# EAGLE design schmatic (EAGLE 9.6.2)

## Sheet 1 of 3
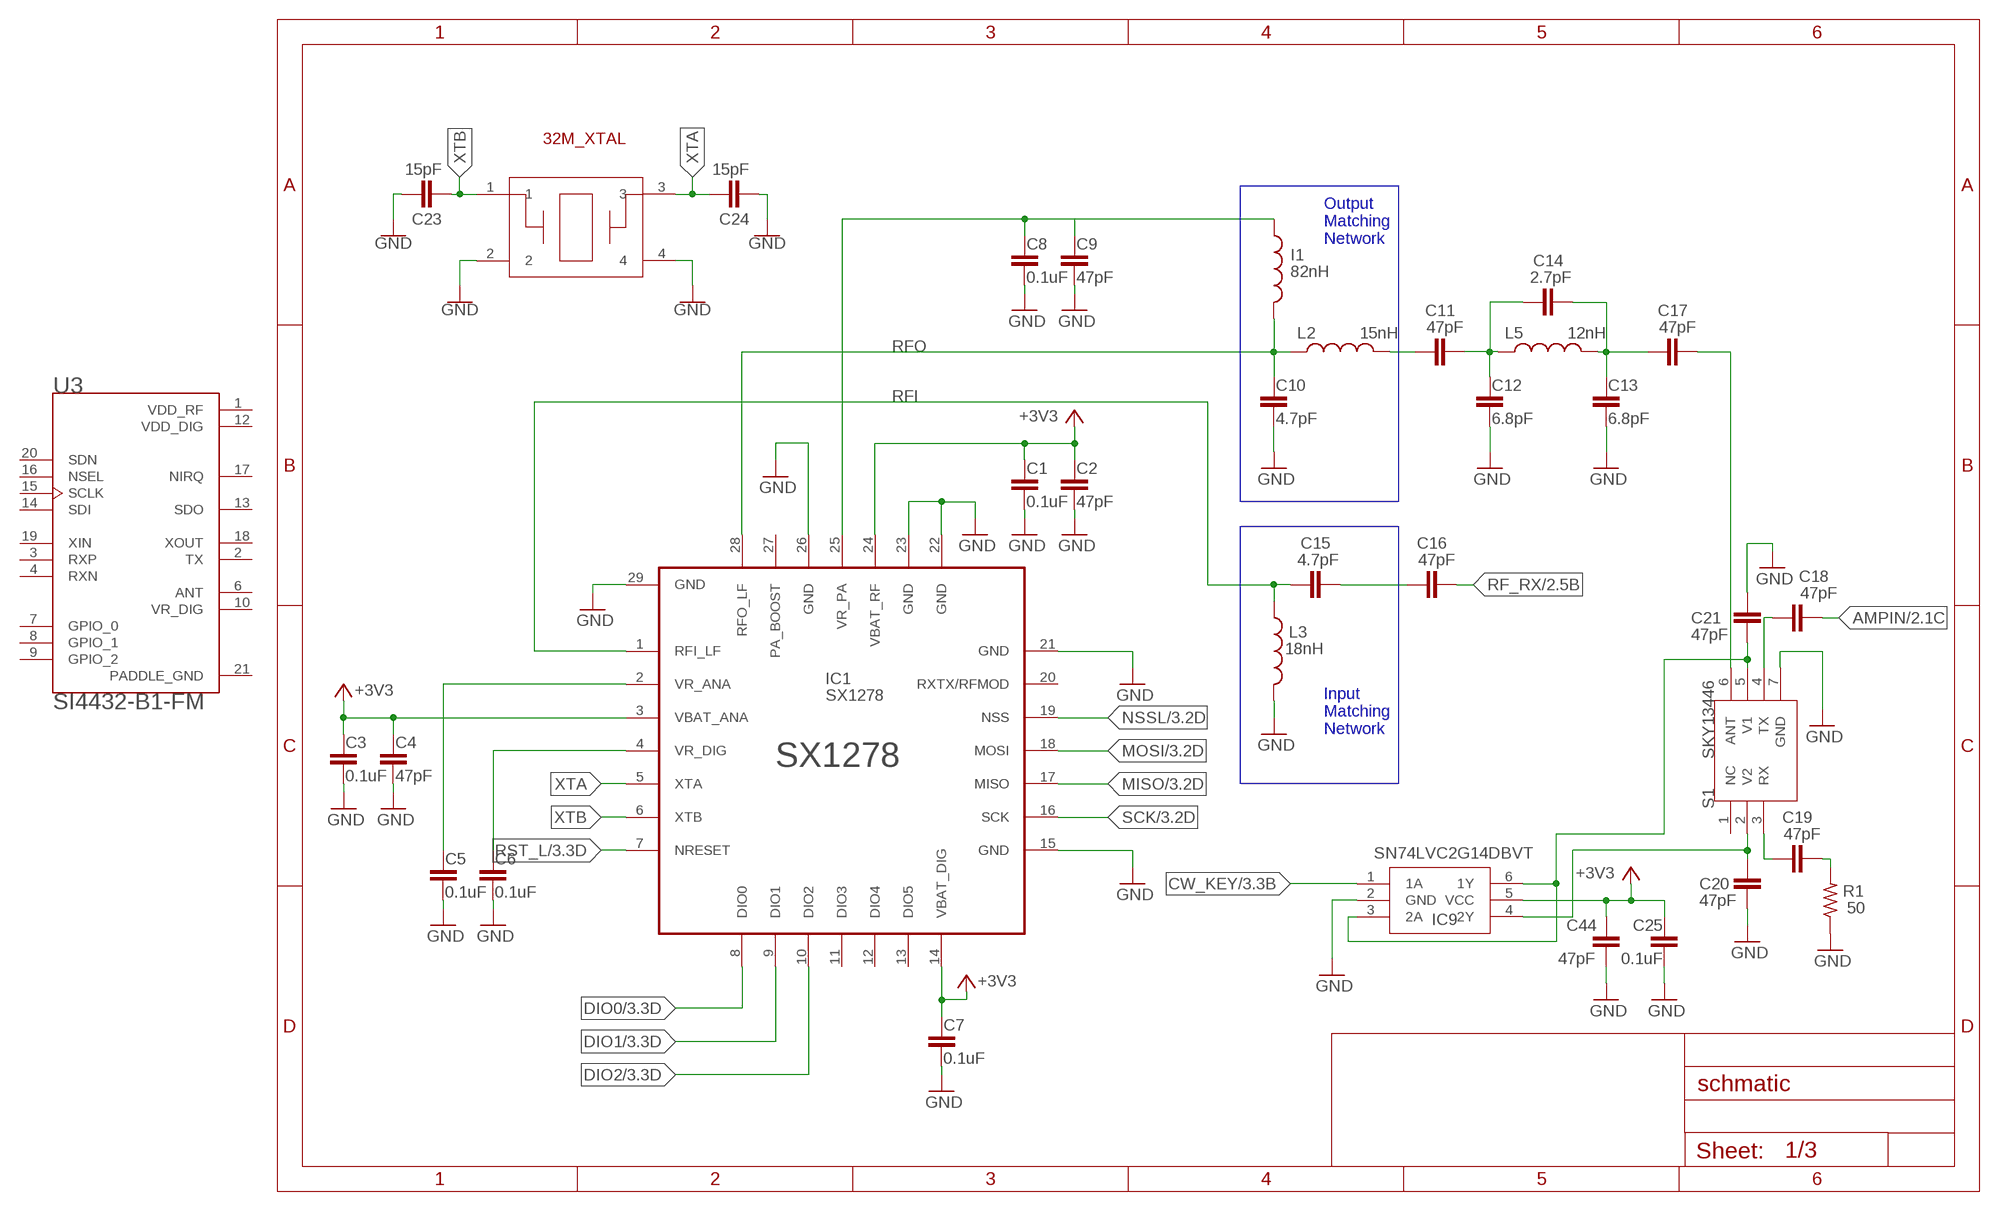
[diagram p0: schematic, sheet 1]

### Parts
C1  0.1uF  CAPACITOR  [M(1005)_US(0402)]
C2  47pF  CAPACITOR  [M(1005)_US(0402)]
C3  0.1uF  CAPACITOR  [M(1005)_US(0402)]
C4  47pF  CAPACITOR  [M(1005)_US(0402)]
C5  0.1uF  CAPACITOR  [M(1005)_US(0402)]
C6  0.1uF  CAPACITOR  [M(1005)_US(0402)]
C7  0.1uF  CAPACITOR  [M(1005)_US(0402)]
C8  0.1uF  CAPACITOR  [M(1005)_US(0402)]
C9  47pF  CAPACITOR  [M(1005)_US(0402)]
C10  4.7pF  CAPACITOR  [M(1005)_US(0402)]
C11  47pF  CAPACITOR  [M(1005)_US(0402)]
C12  6.8pF  CAPACITOR  [M(1005)_US(0402)]
C13  6.8pF  CAPACITOR  [M(1005)_US(0402)]
C14  2.7pF  CAPACITOR  [M(1005)_US(0402)]
C15  4.7pF  CAPACITOR  [M(1005)_US(0402)]
C16  47pF  CAPACITOR  [M(1005)_US(0402)]
C17  47pF  CAPACITOR  [M(1005)_US(0402)]
C18  47pF  CAPACITOR  [M(1005)_US(0402)]
C19  47pF  CAPACITOR  [M(1005)_US(0402)]
C20  47pF  CAPACITOR  [M(1005)_US(0402)]
C21  47pF  CAPACITOR  [M(1005)_US(0402)]
C23  15pF  CAP_(M1005)_0402  [CAP_(M1005)_0402]
C24  15pF  CAP_(M1005)_0402  [CAP_(M1005)_0402]
C25  0.1uF  CAPACITOR  [M(1005)_US(0402)]
C44  47pF  CAPACITOR  [M(1005)_US(0402)]
I1  82nH  INDUCTOR1608  [M(1608)_US(0603)]
IC1  SX1278  [SX1278]
IC9  SN74LVC2G14DBVT  SN74LVC2G34DBVR  [SOT-23-6]
L2  15nH  INDUCTOR  [M(1005)_US(0402)]
L3  18nH  INDUCTOR  [M(1005)_US(0402)]
L5  12nH  INDUCTOR  [M(1005)_US(0402)]
Q1  NX2520SA-32MHZ  [NX2520SA]
R1  50  RESISTOR1608  [M(1608)_US(0603)]
S1  SKY13446  [SKY13446]
U3  SI4432-B1-FM  [QFN50P400X400X90-21N]

### Nets
+3V1: C5.1 IC1.2(VR_ANA)
+3V2: C6.1 IC1.4(VR_DIG)
+3V3: C1.1 C2.1 C3.1 C4.1 C7.1 C25.1 C44.1 IC1.3(VBAT_ANA) IC1.14(VBAT_DIG) IC1.24(VBAT_RF) IC9.5(VCC) ; also sheet 2,3
+3V4: C8.1 C9.1 I1.1 IC1.25(VR_PA)
AMPIN: C18.2 ; also sheet 2
CW_KEY: IC9.1(1A) ; also sheet 3
DIO0: IC1.8(DIO0) ; also sheet 3
DIO1: IC1.9(DIO1) ; also sheet 3
DIO2: IC1.10(DIO2) ; also sheet 3
GND: C1.2 C2.2 C3.2 C4.2 C5.2 C6.2 C7.2 C8.2 C9.2 C10.2 C12.2 C13.2 C20.1 C21.2 C23.1 C24.2 C25.2 C44.2 IC1.15(GND) IC1.21(GND) IC1.22(GND) IC1.23(GND) IC1.26(GND) IC1.29(GND) IC9.2(GND) L3.2 Q1.2 Q1.4 R1.1 S1.7(GND) ; also sheet 2,3
MISO: IC1.17(MISO) ; also sheet 3
MOSI: IC1.18(MOSI) ; also sheet 3
N$1: C11.1 L2.2
N$2: C11.2 C12.1 C14.1 L5.1
N$3: C13.1 C14.2 C17.1 L5.2
N$4: C17.2 S1.6(ANT)
N$5: C15.2 C16.1
N$6: C18.1 S1.4(TX)
N$7: C19.1 S1.3(RX)
N$8: C19.2 R1.2
N$11: C20.2 IC9.4(2Y) S1.2(V2)
N$27: C21.1 IC9.3(2A) IC9.6(1Y) S1.5(V1)
NSSL: IC1.19(NSS) ; also sheet 3
RF_RX: C16.2 ; also sheet 2
RFI: C15.1 IC1.1(RFI_LF) L3.1
RFO: C10.1 I1.2 IC1.28(RFO_LF) L2.1
RST_L: IC1.7(NRESET) ; also sheet 3
SCK: IC1.16(SCK) ; also sheet 3
XTA: C24.1 IC1.5(XTA) Q1.3
XTB: C23.2 IC1.6(XTB) Q1.1
Unconnected: IC1.11(DIO3) IC1.12(DIO4) IC1.13(DIO5) IC1.20(RXTX/RFMOD) IC1.27(PA_BOOST) S1.1(NC) U3.2(TX) U3.3(RXP) U3.4(RXN) U3.6(ANT) U3.7(GPIO_0) U3.8(GPIO_1) U3.9(GPIO_2) U3.10(VR_DIG) U3.13(SDO) U3.14(SDI) U3.15(SCLK) U3.16(NSEL) U3.17(NIRQ) U3.18(XOUT) U3.19(XIN) U3.20(SDN) U3.21(PADDLE_GND)

### Buses
B$1
B$2

### Notes on the sheet
- 32M_XTAL
- Output
  Matching
  Network
- Input
  Matching
  Network

## Sheet 2 of 3
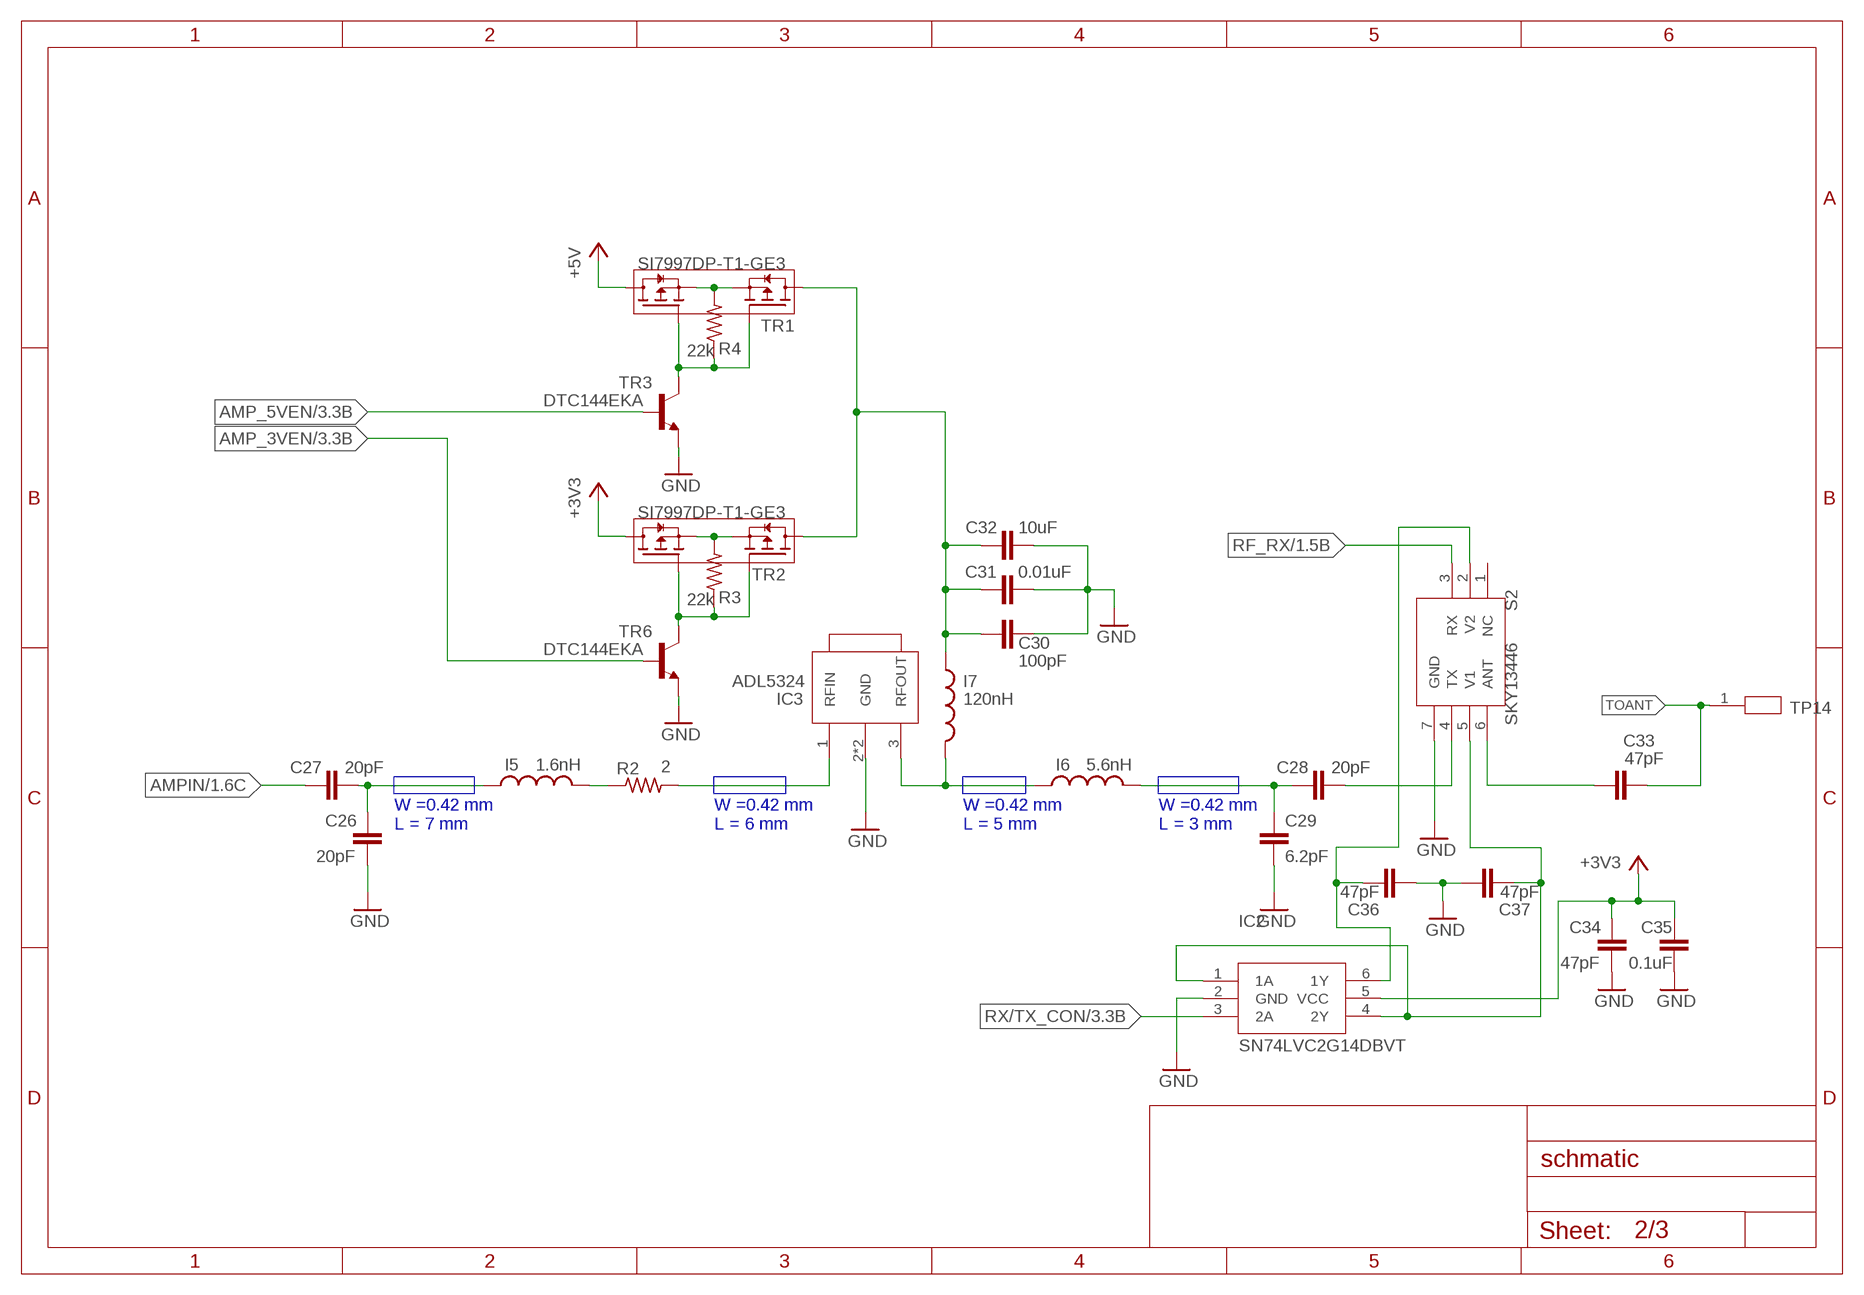
[diagram p1: schematic, sheet 2]

### Parts
C26  20pF  CAPACITOR  [M(1005)_US(0402)]
C27  20pF  CAPACITOR  [M(1005)_US(0402)]
C28  20pF  CAPACITOR  [M(1005)_US(0402)]
C29  6.2pF  CAPACITOR  [M(1005)_US(0402)]
C30  100pF  CAPACITOR  [M(1005)_US(0402)]
C31  0.01uF  CAPACITOR  [M(1005)_US(0402)]
C32  10uF  CAPACITOR1608  [M(1608)_US(0603)]
C33  47pF  CAPACITOR  [M(1005)_US(0402)]
C34  47pF  CAPACITOR  [M(1005)_US(0402)]
C35  0.1uF  CAPACITOR  [M(1005)_US(0402)]
C36  47pF  CAPACITOR  [M(1005)_US(0402)]
C37  47pF  CAPACITOR  [M(1005)_US(0402)]
I5  1.6nH  INDUCTOR  [M(1005)_US(0402)]
I6  5.6nH  INDUCTOR  [M(1005)_US(0402)]
I7  120nH  INDUCTOR2012  [M(2012)_US(0805)]
IC2  SN74LVC2G14DBVT  SN74LVC2G34DBVR  [SOT-23-6]
IC3  ADL5324  [ADL5324]
R2  2  RESISTOR1608  [M(1608)_US(0603)]
R3  22k  RESISTOR1608  [M(1608)_US(0603)]
R4  22k  RESISTOR1608  [M(1608)_US(0603)]
S2  SKY13446  [SKY13446]
TP14  TEST_POINT  [TEST_POINT_1.5MM]
TR1  SI7997DP-T1-GE3  [SI7997DP-T1-GE3]
TR2  SI7997DP-T1-GE3  [SI7997DP-T1-GE3]
TR3  DTC144EKA  [SOT346-R]
TR6  DTC144EKA  [SOT346-R]

### Nets
+3V3: C34.1 C35.1 IC2.5(VCC) TR2.7(D1) TR2.8(D1) TR2.10(D1) ; also sheet 1,3
+3V5: C30.1
+5V: TR1.7(D1) TR1.8(D1) TR1.10(D1) ; also sheet 3
AMP_3VEN: TR6.2(B) ; also sheet 3
AMP_5VEN: TR3.2(B) ; also sheet 3
AMPIN: C27.1 ; also sheet 1
AMPPWR: C30.2 C31.2 C32.1 I7.1 TR1.5(D2) TR1.6(D2) TR1.9(D2) TR2.5(D2) TR2.6(D2) TR2.9(D2)
GND: C26.2 C29.2 C31.1 C32.2 C34.2 C35.2 C36.1 C37.2 IC2.2(GND) IC3.2(GND) IC3.4(GND) S2.7(GND) TR3.1(E) TR6.1(E) ; also sheet 1,3
N$9: C26.1 C27.2 I5.1
N$10: C37.1 IC2.1(1A) IC2.4(2Y) S2.5(V1)
N$12: I5.2 R2.1
N$13: IC3.1(RFIN) R2.2
N$14: I6.1 I7.2 IC3.3(RFOUT)
N$15: C28.1 C29.1 I6.2
N$16: C28.2 S2.4(TX)
N$17: C33.1 S2.6(ANT)
N$18: R4.2 TR1.1(S1) TR1.3(S2)
N$19: R3.2 TR2.1(S1) TR2.3(S2)
N$20: C36.2 IC2.6(1Y) S2.2(V2)
N$22: R4.1 TR1.2(G1) TR1.4(G2) TR3.3(C)
N$23: R3.1 TR2.2(G1) TR2.4(G2) TR6.3(C)
RF_RX: S2.3(RX) ; also sheet 1
RX/TX_CON: IC2.3(2A) ; also sheet 3
TOANT: C33.2 TP14.1
Unconnected: S2.1(NC)

### Buses
B$3
B$4
B$5
B$6

### Notes on the sheet
- W =0.42 mm
  L = 7 mm
- W =0.42 mm
  L = 6 mm
- W =0.42 mm
  L = 5 mm
- W =0.42 mm
  L = 3 mm

## Sheet 3 of 3
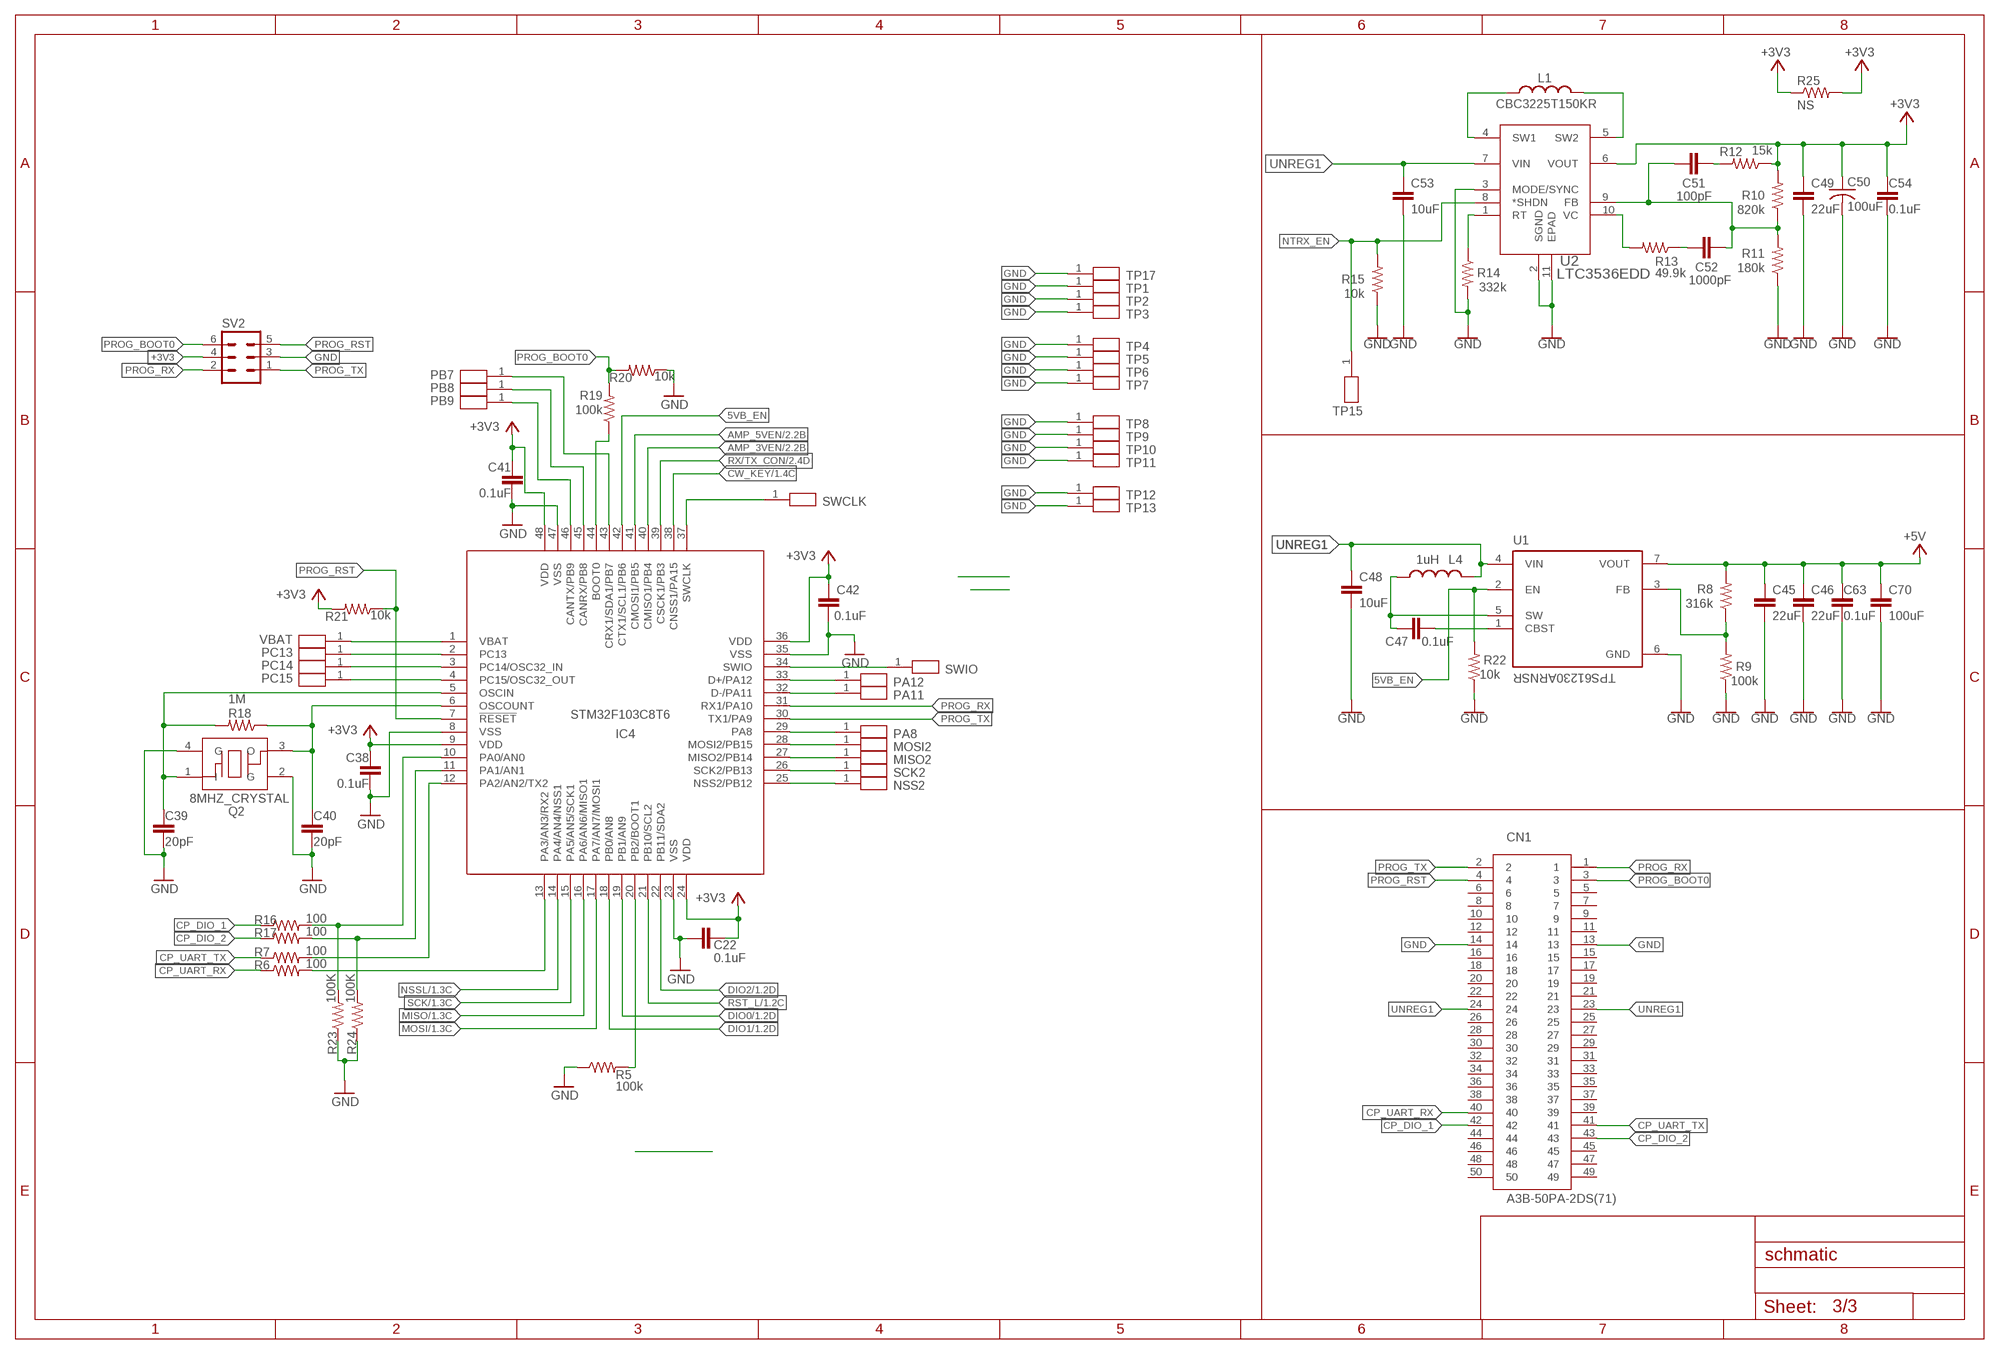
[diagram p2: schematic, sheet 3]

### Parts
C22  0.1uF  CAPACITOR  [M(1005)_US(0402)]
C38  0.1uF  CAPACITOR  [M(1005)_US(0402)]
C39  20pF  CAPACITOR  [M(1005)_US(0402)]
C40  20pF  CAPACITOR  [M(1005)_US(0402)]
C41  0.1uF  CAPACITOR  [M(1005)_US(0402)]
C42  0.1uF  CAPACITOR  [M(1005)_US(0402)]
C45  22uF  CAPACITOR1608  [M(1608)_US(0603)]
C46  22uF  CAPACITOR1608  [M(1608)_US(0603)]
C47  0.1uF  CAPACITOR  [M(1005)_US(0402)]
C48  10uF  CAPACITOR1608  [M(1608)_US(0603)]
C49  22uF  CAPACITOR1608  [M(1608)_US(0603)]
C50  100uF  C-USC1210  [C1210]
C51  100pF  CAPACITOR  [M(1005)_US(0402)]
C52  1000pF  CAPACITOR  [M(1005)_US(0402)]
C53  10uF  CAPACITOR1608  [M(1608)_US(0603)]
C54  0.1uF  CAPACITOR  [M(1005)_US(0402)]
C63  0.1uF  CAPACITOR  [M(1005)_US(0402)]
C70  100uF  CAPACITOR2012  [M(2012)_US(0805)]
CN1  A3B-50PA-2DS(71)  [A3B-50PA-2DS(71)]
IC4  STM32F103C8T6  [STM32F103C8T6]
L1  CBC3225T150KR  INDUCTOR3225  [M(3225)_US(1210)]
L4  1uH  AMDLA3020S-1R5MT  [AMDLA3020S-1R5MT]
MISO2  TEST_POINT  [TEST_POINT_1.5MM]
MOSI2  TEST_POINT  [TEST_POINT_1.5MM]
NSS2  TEST_POINT  [TEST_POINT_1.5MM]
PA8  TEST_POINT  [TEST_POINT_1.5MM]
PA11  TEST_POINT  [TEST_POINT_1.5MM]
PA12  TEST_POINT  [TEST_POINT_1.5MM]
PB7  TEST_POINT  [TEST_POINT_1.5MM]
PB8  TEST_POINT  [TEST_POINT_1.5MM]
PB9  TEST_POINT  [TEST_POINT_1.5MM]
PC13  TEST_POINT  [TEST_POINT_1.5MM]
PC14  TEST_POINT  [TEST_POINT_1.5MM]
PC15  TEST_POINT  [TEST_POINT_1.5MM]
Q2  8MHZ_CRYSTAL  [ECS-80-18-30B-JEM-TR]
R5  100k  RESISTOR  [M(1005)_US(0402)]
R6  100  RESISTOR  [M(1005)_US(0402)]
R7  100  RESISTOR  [M(1005)_US(0402)]
R8  316k  RESISTOR1608  [M(1608)_US(0603)]
R9  100k  RESISTOR1608  [M(1608)_US(0603)]
R10  820k  RESISTOR1608  [M(1608)_US(0603)]
R11  180k  RESISTOR1608  [M(1608)_US(0603)]
R12  15k  RESISTOR1608  [M(1608)_US(0603)]
R13  49.9k  RESISTOR1608  [M(1608)_US(0603)]
R14  332k  RESISTOR1608  [M(1608)_US(0603)]
R15  10k  RESISTOR  [M(1005)_US(0402)]
R16  100  RESISTOR  [M(1005)_US(0402)]
R17  100  RESISTOR  [M(1005)_US(0402)]
R18  1M  RESISTOR1608  [M(1608)_US(0603)]
R19  100k  RESISTOR  [M(1005)_US(0402)]
R20  10k  RESISTOR  [M(1005)_US(0402)]
R21  10k  RESISTOR  [M(1005)_US(0402)]
R22  10k  RESISTOR  [M(1005)_US(0402)]
R23  100K  RESISTOR  [M(1005)_US(0402)]
R24  100K  RESISTOR  [M(1005)_US(0402)]
R25  NS  RESISTOR2012  [M(2012)_US(0805)]
SCK2  TEST_POINT  [TEST_POINT_1.5MM]
SV2  MA03-2  [MA03-2]
SWCLK  TEST_POINT  [TEST_POINT_1.5MM]
SWIO  TEST_POINT  [TEST_POINT_1.5MM]
TP1  TEST_POINT  [TEST_POINT_1.5MM]
TP2  TEST_POINT  [TEST_POINT_1.5MM]
TP3  TEST_POINT  [TEST_POINT_1.5MM]
TP4  TEST_POINT  [TEST_POINT_1.5MM]
TP5  TEST_POINT  [TEST_POINT_1.5MM]
TP6  TEST_POINT  [TEST_POINT_1.5MM]
TP7  TEST_POINT  [TEST_POINT_1.5MM]
TP8  TEST_POINT  [TEST_POINT_1.5MM]
TP9  TEST_POINT  [TEST_POINT_1.5MM]
TP10  TEST_POINT  [TEST_POINT_1.5MM]
TP11  TEST_POINT  [TEST_POINT_1.5MM]
TP12  TEST_POINT  [TEST_POINT_1.5MM]
TP13  TEST_POINT  [TEST_POINT_1.5MM]
TP15  TEST_POINT  [TEST_POINT_1.5MM]
TP17  TEST_POINT  [TEST_POINT_1.5MM]
U1  TPS61230ARNSR  [IC_TPS61230ARNSR]
U2  LTC3536EDD  LTC3536EDD#TRPBF  [DFN-10_DD]
VBAT  TEST_POINT  [TEST_POINT_1.5MM]

### Nets
5VB_EN: IC4.42(CTX1/SCL1/PB6) R22.2 U1.2(EN)
+3V3: C22.1 C38.1 C41.1 C42.1 C49.1 C50.1 C54.1 IC4.9(VDD) IC4.24(VDD) IC4.36(VDD) IC4.48(VDD) R10.2 R12.1 R21.2 R25.1 R25.2 SV2.4 U2.6(VOUT) ; also sheet 1,2
+5V: C45.1 C46.1 C63.1 C70.1 R8.2 U1.7(VOUT) ; also sheet 2
AMP_3VEN: IC4.40(CMISO1/PB4) ; also sheet 2
AMP_5VEN: IC4.41(CMOSI1/PB5) ; also sheet 2
C_UART_RX: IC4.13(PA3/AN3/RX2) R6.2
C_UART_TX: IC4.12(PA2/AN2/TX2) R7.2
CP_DIO_1: CN1.42 R16.1
CP_DIO_2: CN1.43 R17.1
CP_UART_RX: CN1.40 R6.1
CP_UART_TX: CN1.41 R7.1
CW_KEY: IC4.38(CNSS1/PA15) ; also sheet 1
DIO0: IC4.19(PB1/AN9) ; also sheet 1
DIO1: IC4.18(PB0/AN8) ; also sheet 1
DIO2: IC4.22(PB11/SDA2) ; also sheet 1
GND: C22.2 C38.2 C39.2 C40.2 C41.2 C42.2 C45.2 C46.2 C48.2 C49.2 C50.2 C53.2 C54.2 C63.2 C70.2 CN1.13 CN1.14 IC4.8(VSS) IC4.23(VSS) IC4.35(VSS) IC4.47(VSS) Q2.2(G) Q2.4(G) R5.1 R9.1 R11.1 R14.2 R15.1 R20.1 R22.1 R23.1 R24.1 SV2.3 TP1.1 TP2.1 TP3.1 TP4.1 TP5.1 TP6.1 TP7.1 TP8.1 TP9.1 TP10.1 TP11.1 TP12.1 TP13.1 TP17.1 U1.6(GND) U2.2(SGND) U2.3(MODE/SYNC) U2.11(EPAD) ; also sheet 1,2
MISO: IC4.16(PA6/AN6/MISO1) ; also sheet 1
MOSI: IC4.17(PA7/AN7/MOSI1) ; also sheet 1
N$24: IC4.10(PA0/AN0) R16.2 R23.2
N$25: IC4.20(PB2/BOOT1) R5.2
N$26: IC4.11(PA1/AN1) R17.2 R24.2
N$28: C39.1 IC4.5(OSCIN) Q2.1(I) R18.2
N$29: C40.1 IC4.6(OSCOUNT) Q2.3(O) R18.1
N$30: L1.1 U2.4(SW1)
N$31: R8.1 R9.2 U1.3(FB)
N$32: C47.1 L4.1 U1.5(SW)
N$33: L1.2 U2.5(SW2)
N$34: C47.2 U1.1(CBST)
N$35: IC4.1(VBAT) VBAT.1
N$36: C51.2 R12.2
N$37: C51.1 C52.2 R10.1 R11.2 U2.9(FB)
N$38: IC4.44(BOOT0) R19.1
N$39: C52.1 R13.1
N$40: R13.2 U2.10(VC)
N$41: R14.1 U2.1(RT)
N$42: IC4.4(PC15/OSC32_OUT) PC15.1
N$44: IC4.3(PC14/OSC32_IN) PC14.1
N$45: IC4.2(PC13) PC13.1
N$46: IC4.27(MISO2/PB14) MISO2.1
N$47: IC4.28(MOSI2/PB15) MOSI2.1
N$48: IC4.33(D+/PA12) PA12.1
N$49: IC4.32(D-/PA11) PA11.1
N$50: IC4.29(PA8) PA8.1
N$68: IC4.26(SCK2/PB13) SCK2.1
N$69: IC4.25(NSS2/PB12) NSS2.1
NSSL: IC4.14(PA4/AN4/NSS1) ; also sheet 1
NTRX_EN: R15.2 TP15.1 U2.8(*SHDN)
PB7: IC4.43(CRX1/SDA1/PB7) PB7.1
PB8: IC4.45(CANRX/PB8) PB8.1
PB9: IC4.46(CANTX/PB9) PB9.1
PROG_BOOT0: CN1.3 R19.2 R20.2 SV2.6
PROG_RST: CN1.4 IC4.7(!RESET) R21.1 SV2.5
PROG_RX: CN1.1 IC4.31(RX1/PA10) SV2.2
PROG_TX: CN1.2 IC4.30(TX1/PA9) SV2.1
RST_L: IC4.21(PB10/SCL2) ; also sheet 1
RX/TX_CON: IC4.39(CSCK1/PB3) ; also sheet 2
SCK: IC4.15(PA5/AN5/SCK1) ; also sheet 1
SWCLK: IC4.37(SWCLK) SWCLK.1
SWIO: IC4.34(SWIO) SWIO.1
UNREG1: C48.1 C53.1 CN1.23 CN1.24 L4.2 U1.4(VIN) U2.7(VIN)
Unconnected: CN1.5 CN1.6 CN1.7 CN1.8 CN1.9 CN1.10 CN1.11 CN1.12 CN1.15 CN1.16 CN1.17 CN1.18 CN1.19 CN1.20 CN1.21 CN1.22 CN1.25 CN1.26 CN1.27 CN1.28 CN1.29 CN1.30 CN1.31 CN1.32 CN1.33 CN1.34 CN1.35 CN1.36 CN1.37 CN1.38 CN1.39 CN1.44 CN1.45 CN1.46 CN1.47 CN1.48 CN1.49 CN1.50

## Power pins joined to a net without a drawn wire
VDD_DIG: U3.12(VDD_DIG)
VDD_RF: U3.1(VDD_RF)

## Library data of the parts
C1-C22 C25-C42 C44-C49 C51-C54 C63 C70 = Tharindu_lib:CAPACITOR
C23 C24 = Tharindu:CAP_(M1005)_0402
C50 = adafruit:C-US: CAPACITOR, American symbol
CN1 = Tharindu1:A3B-50PA-2DS(71)
I1 I5-I7 L1-L3 L5 = Tharindu_lib:INDUCTOR
IC1 = Tharindu:SX1278
IC2 IC9 = Tharindu:SN74LVC2G34DBVR
IC3 = Tharindu:ADL5324
IC4 = Tharindu:STM32F103C8T6
L4 = Tharindu:AMDLA3020S-1R5MT
MISO2 MOSI2 NSS2 PA8 PA11 PA12 PB7-PB9 PC13-PC15 SCK2 SWCLK SWIO TP1-TP15 TP17 VBAT = Tharindu:TEST_POINT
Q1 = Tharindu:NX2520SA-32MHZ
Q2 = Tharindu:8MHZ_CRYSTAL
R1-R25 = Tharindu_lib:RESISTOR
S1 S2 = Tharindu:SKY13446
SV2 = con-lstb:MA03-2: PIN HEADER; OC_FARNELL: unknown; OC_NEWARK: unknown
TR1 TR2 = Tharindu:SI7997DP-T1-GE3
TR3 TR6 = BIRDS3_CAM_MSN:DTC144EKA
U1 = TPS61230ARNSR:TPS61230ARNSR: Boost Switching Regulator IC Positive Adjustable 2.5V 1 Output 6A (Switch) 7-VFQFN Check availability <https://pricing.snapeda.com/parts/TPS61230ARNSR/Texas%20Instruments/view-part?ref=eda>; AVAILABILITY: In Stock; DESCRIPTION: 5-V/6-A High Efficiency Step-Up Converter in 2.0-mm x 2.0-mm QFN Package; MF: Texas Instruments; MP: TPS61230ARNSR; PACKAGE: VQFN-HR-7 Texas Instruments; PRICE: None; PURCHASE-URL: https://pricing.snapeda.com/search/part/TPS61230ARNSR/?ref=eda
U2 = LTC3536EDD_TRPBF:LTC3536EDD#TRPBF: Check availability <https://pricing.snapeda.com/parts/LTC3536EDD%23TRPBF/Analog%20Devices/view-part?ref=eda>; AVAILABILITY: In Stock; DESCRIPTION: 1A Low Noise, Buck-Boost DC/DC Converter; MF: Analog Devices; MP: LTC3536EDD#TRPBF; PACKAGE: DFN -10 Analog Devices; PRICE: None; PURCHASE-URL: https://pricing.snapeda.com/search/part/LTC3536EDD#TRPBF/?ref=eda
U3 = SI4432-B1-FM:SI4432-B1-FM: RF Transceiver FSK/GFSK/OOK 3V 20-Pin QFN EP; DESCRIPTION: IC RF TxRx Only General ISM < 1GHz - 240MHz ~ 930MHz 20-VFQFN Exposed Pad; DIGI-KEY_PART_NUMBER: 336-2522-5-ND; MF: Silicon Labs; MP: SI4432-B1-FM; PACKAGE: VFQFN-20 Silicon Labs; PURCHASE-URL: https://pricing.snapeda.com/search?q=SI4432-B1-FM&ref=eda

## Net classes
0 default: width 0.203 mm, drill 0.33 mm, clearance 0.203 mm
2 gnd: width 0.305 mm, drill 0.33 mm, clearance 0.203 mm
3 power usb: width 0.508 mm, drill 0.33 mm, clearance 0.203 mm

## Board
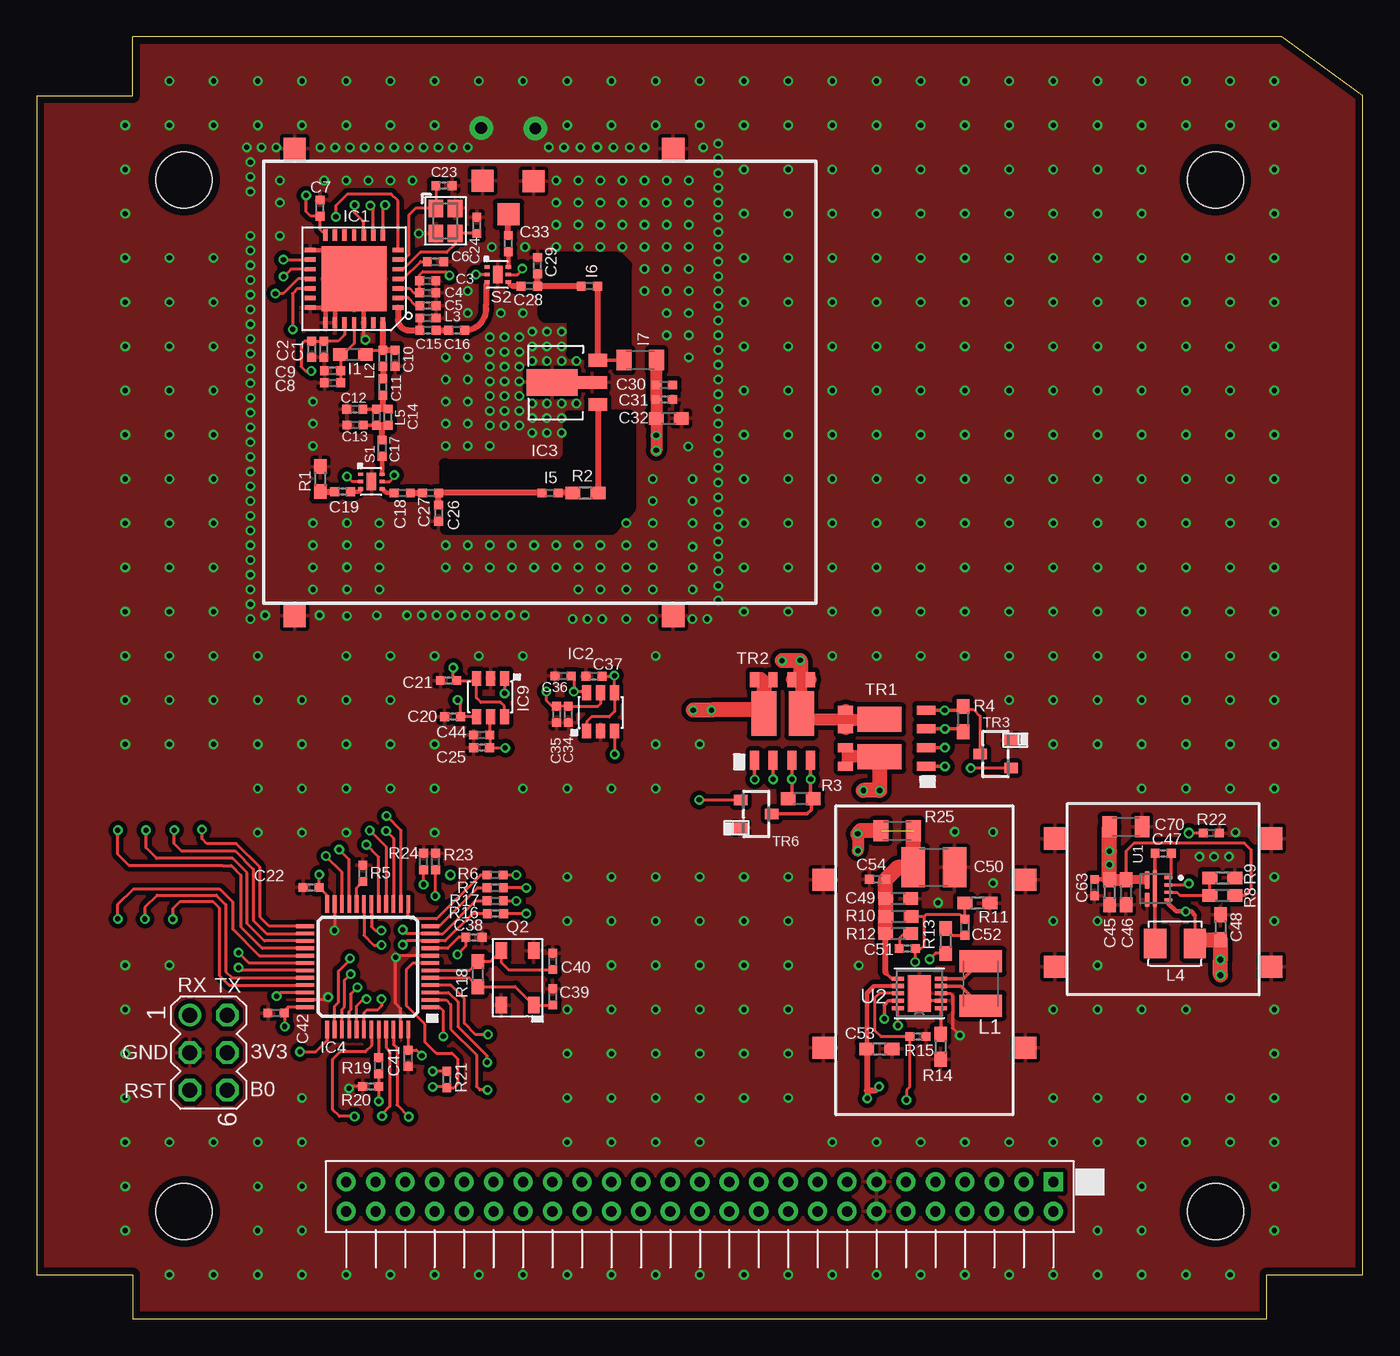
[diagram p3: board, top side]
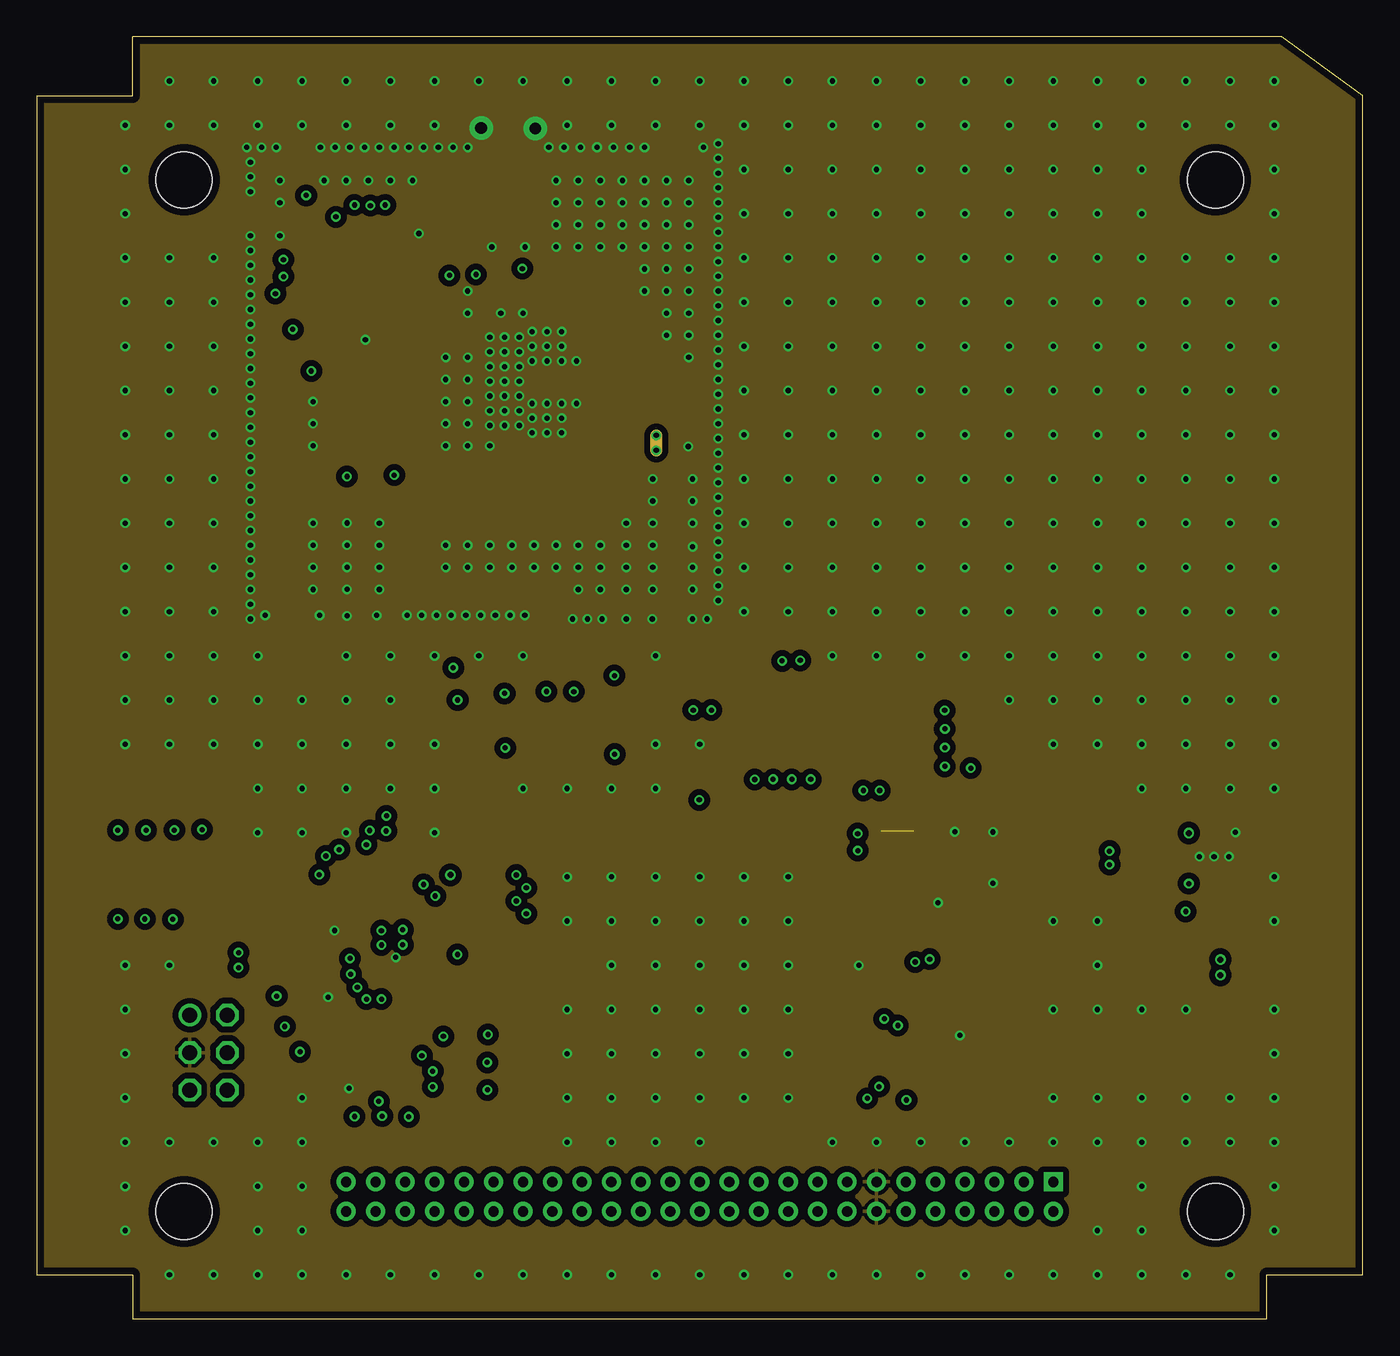
[diagram p4: board, inner layer Route2]
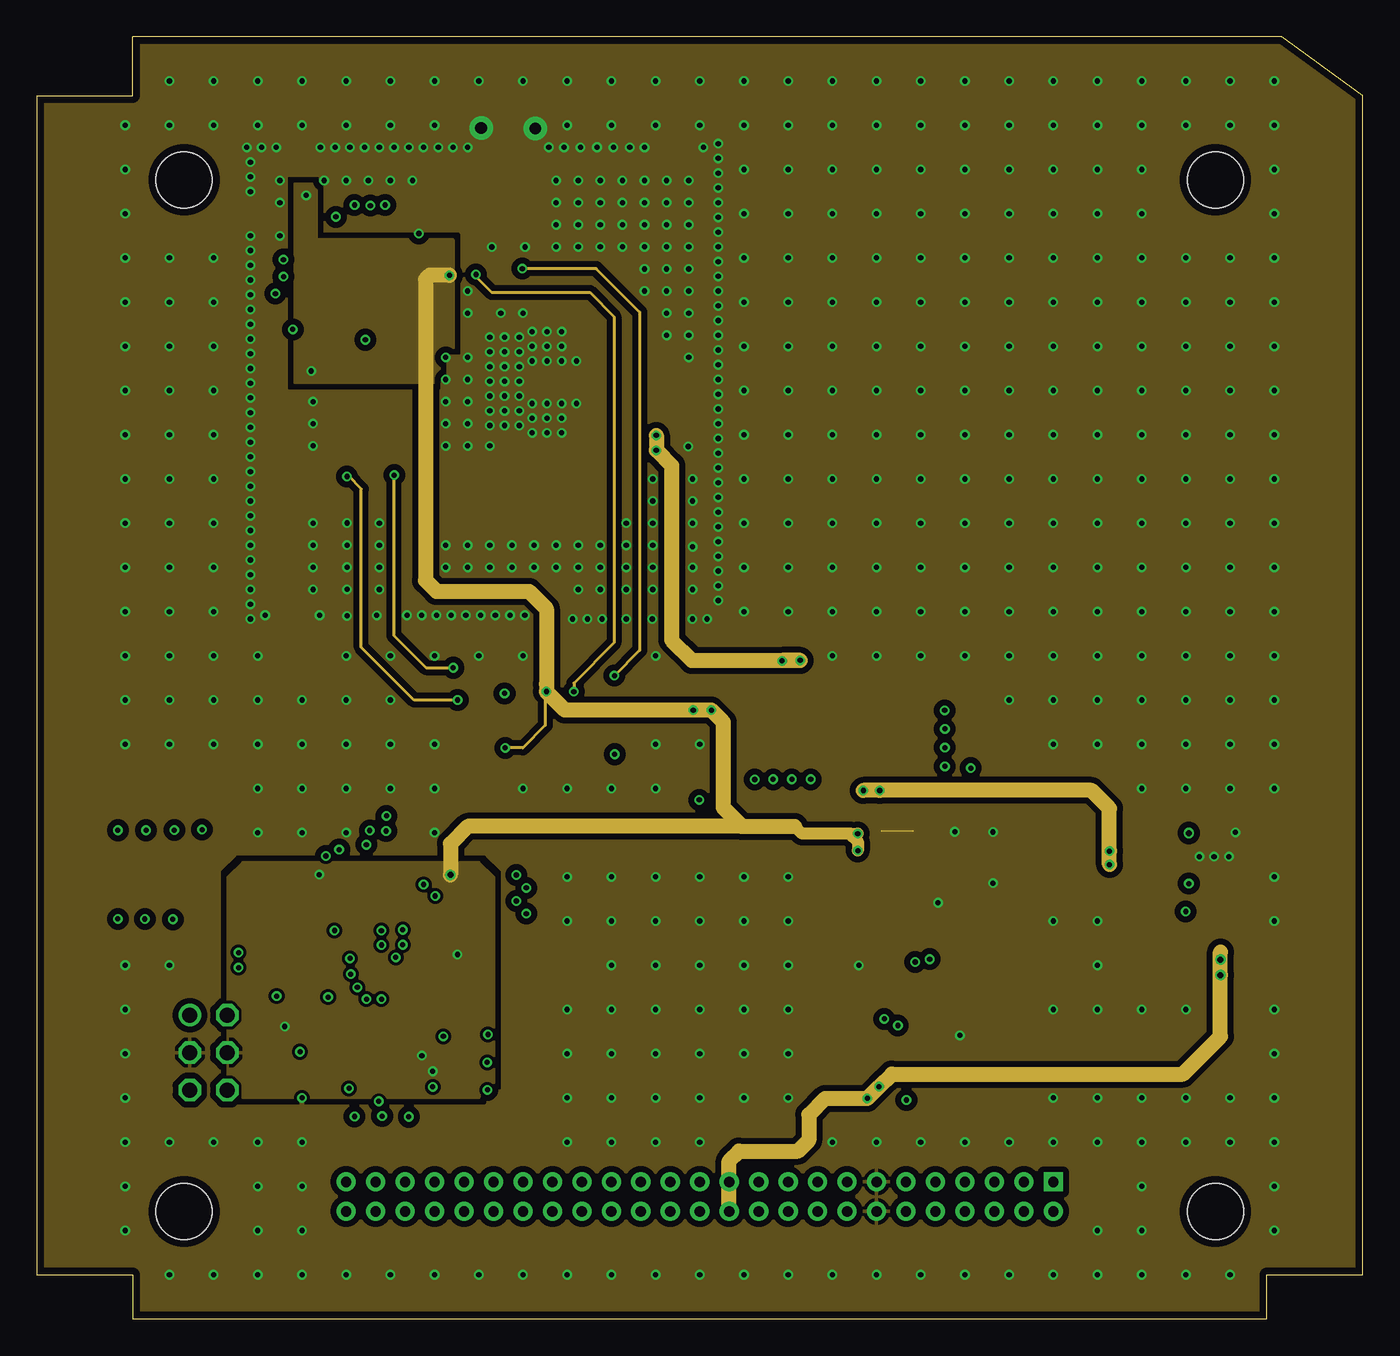
[diagram p5: board, inner layer Route15]
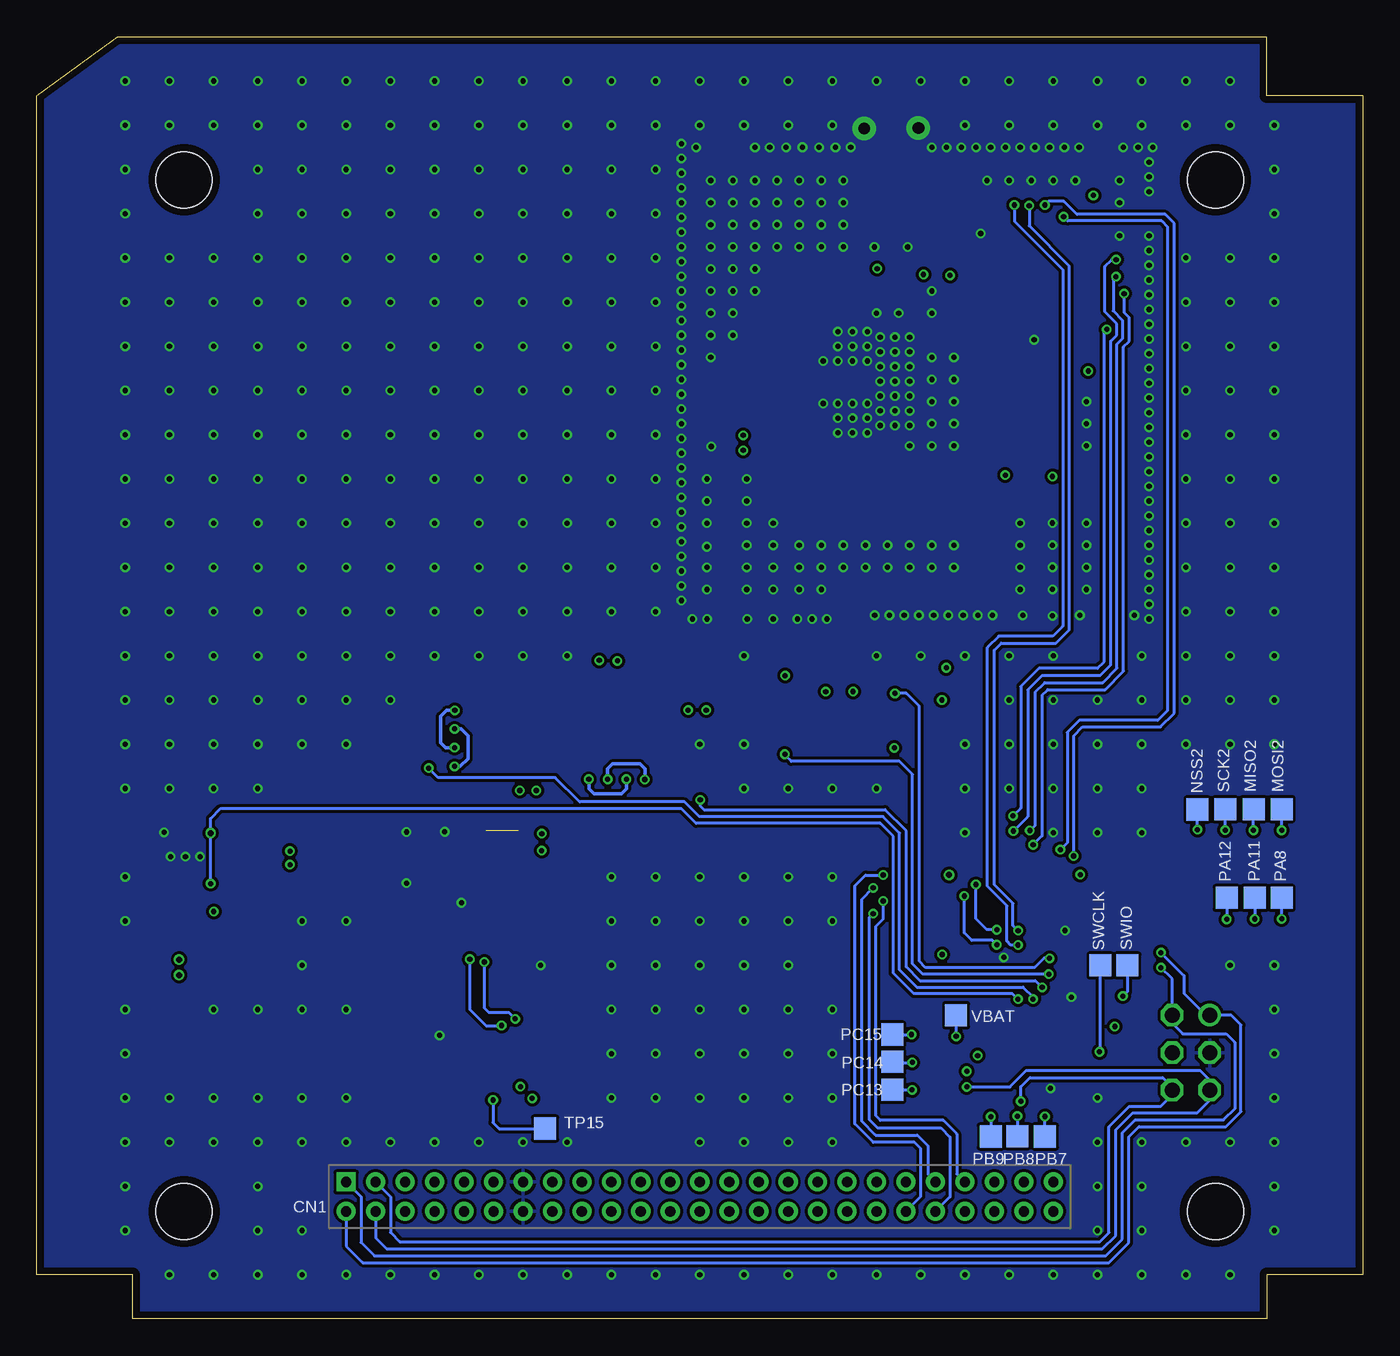
[diagram p6: board, bottom side, seen from below]

Size 90 x 87 mm. Coordinates in mm from the lower left corner, seen from the top.
Outline: 6.5,0 83.5,0 83.5,3 90,3 90,83 84.5,87 6.5,87 6.5,83 0,83 0,3 6.5,3 6.5,0
Copper layers (1+2*15+16): Top 0.018mm / dielectric 0.25mm / Route2 0.035mm / dielectric 1mm / Route15 0.035mm / dielectric 0.25mm / Bottom 0.018mm
Design rules "pban_5mil-l4": minimum track width 5mil, minimum drill 0.3mm, track to track 5mil, track to pad 0.229mm, pad to pad 5mil, via to via 5mil, smd to smd 5mil, copper to edge 0.5mm, drill to drill 0.5mm, minimum pad ring 0.15mm, minimum via ring 0.15mm, stop-mask expansion 4mil, vias tented up to drill 0.35mm, thermal gap 10mil
Holes 3.8 mm at 80,7.3 10,7.3 10,77.3 80,77.3
tRestrict: 19 lines

### Footprints (pad centres in the part's own frame; a part is rotated, then mirrored left to right if it is on the bottom)
M(1005)_US(0402) = smd 0.6 x 0.6: 1 -0.55,0; 2 0.55,0
CAP_(M1005)_0402 = smd 0.6 x 0.6: 1 -0.55,0; 2 0.55,0
M(1608)_US(0603) = smd 1 x 0.85: 1 -0.85,0; 2 0.85,0
C1210 = smd 1.6 x 2.7: 1 -1.4,0; 2 1.4,0
M(2012)_US(0805) = smd 1 x 1.4: 1 -1.1,0; 2 1.1,0
A3B-50PA-2DS(71) = drill 0.7 pad 1.3 square: 1 0,2 | drill 0.7 pad 1.3: 2 0,0; 3 2,2; 4 2,0; 5 4,2; 6 4,0; 7 6,2; 8 6,0; 9 8,2; 10 8,0; 11 10,2; 12 10,0; 13 12,2; 14 12,0; 15 14,2; 16 14,0; 17 16,2; 18 16,0; 19 18,2; 20 18,0; 21 20,2; 22 20,0; 23 22,2; 24 22,0; 25 24,2; 26 24,0; 27 26,2; 28 26,0; 29 28,2; 30 28,0; 31 30,2; 32 30,0; 33 32,2; 34 32,0; 35 34,2; 36 34,0; 37 36,2; 38 36,0; 39 38,2; 40 38,0; 41 40,2; 42 40,0; 43 42,2; 44 42,0; 45 44,2; 46 44,0; 47 46,2; 48 46,0; 49 48,2; 50 48,0
SX1278 = smd 0.75 x 0.3: 1 -2.975,1.95; 2 -2.975,1.3; 3 -2.975,0.65; 4 -2.975,0; 5 -2.975,-0.65; 6 -2.975,-1.3; 7 -2.975,-1.95; 15 2.975,-1.95; 16 2.975,-1.3; 17 2.975,-0.65; 18 2.975,0; 19 2.975,0.65; 20 2.975,1.3; 21 2.975,1.95 | smd 0.3 x 0.75: 8 -1.95,-2.975; 9 -1.3,-2.975; 10 -0.65,-2.975; 11 0,-2.975; 12 0.65,-2.975; 13 1.3,-2.975; 14 1.95,-2.975; 22 1.95,2.975; 23 1.3,2.975; 24 0.65,2.975; 25 0,2.975; 26 -0.65,2.975; 27 -1.3,2.975; 28 -1.95,2.975 | smd 4.4 x 4.4: 29 0,0
SOT-23-6 = smd 0.6 x 1: 1 -0.95,-1.3; 2 0,-1.3; 3 0.95,-1.3; 4 0.95,1.3; 5 0,1.3; 6 -0.95,1.3
ADL5324 = smd 0.86 x 1.27: 1 -1.5,0; 3 1.5,0 | smd 0.86 x 2: 2 0,0.365 | smd 1.8 x 3.48: 4 0,3.1
STM32F103C8T6 = smd 1.2 x 0.25: 1 -4.25,2.75; 2 -4.25,2.25; 3 -4.25,1.75; 4 -4.25,1.25; 5 -4.25,0.75; 6 -4.25,0.25; 7 -4.25,-0.25; 8 -4.25,-0.75; 9 -4.25,-1.25; 10 -4.25,-1.75; 11 -4.25,-2.25; 12 -4.25,-2.75; 25 4.25,-2.75; 26 4.25,-2.25; 27 4.25,-1.75; 28 4.25,-1.25; 29 4.25,-0.75; 30 4.25,-0.25; 31 4.25,0.25; 32 4.25,0.75; 33 4.25,1.25; 34 4.25,1.75; 35 4.25,2.25; 36 4.25,2.75 | smd 0.25 x 1.2: 13 -2.75,-4.25; 14 -2.25,-4.25; 15 -1.75,-4.25; 16 -1.25,-4.25; 17 -0.75,-4.25; 18 -0.25,-4.25; 19 0.25,-4.25; 20 0.75,-4.25; 21 1.25,-4.25; 22 1.75,-4.25; 23 2.25,-4.25; 24 2.75,-4.25; 37 2.75,4.25; 38 2.25,4.25; 39 1.75,4.25; 40 1.25,4.25; 41 0.75,4.25; 42 0.25,4.25; 43 -0.25,4.25; 44 -0.75,4.25; 45 -1.25,4.25; 46 -1.75,4.25; 47 -2.25,4.25; 48 -2.75,4.25
M(3225)_US(1210) = smd 1.5 x 2.9: 1 -1.5,0; 2 1.5,0
AMDLA3020S-1R5MT = smd 1.5 x 2: 1 -1.35,0; 2 1.35,0
TEST_POINT_1.5MM = smd 1.5 x 1.5: 1 0,0
NX2520SA = smd 1.2 x 1: 1 -0.85,-0.65; 2 0.85,-0.65; 3 0.85,0.65; 4 -0.85,0.65
ECS-80-18-30B-JEM-TR = smd 1.1 x 0.8: 1 -1.85,-1.1; 2 1.85,-1.1; 3 1.85,1.1; 4 -1.85,1.1
SKY13446 = smd 0.229 x 0.35: 1 0,0; 2 0.5,0; 3 1,0; 4 1,1.45; 5 0.5,1.45; 6 0,1.45 | smd 1.2 x 0.66: 7 0.5,0.725
MA03-2 = drill 1.016: 1 -2.54,-1.27 | drill 1.016 octagon: 2 -2.54,1.27; 3 0,-1.27; 4 0,1.27; 5 2.54,-1.27; 6 2.54,1.27
SI7997DP-T1-GE3 = smd 1.27 x 0.61: 1 0,1.905; 2 0,0.635; 3 0,-0.635; 4 0,-1.905 | smd 1.02 x 0.61: 5 5.465,-1.905; 6 5.465,-0.635; 7 5.465,0.635; 8 5.465,1.905 | smd 3 x 1.7: 9 3.175,-1.27; 10 3.175,1.27
SOT346-R = smd 0.7 x 0.9: 1 0.95,-1.05; 2 -0.95,-1.05; 3 0,1.05
IC_TPS61230ARNSR = smd 0.25 x 0.6: 1 -0.75,0.9; 2 -0.25,0.9; 3 0.25,0.9; 4 0.75,0.9 | smd 2.5 x 0.279: 5 0,-0.015 | smd 1 x 0.33: 6 0.75,-0.54 | smd 1.219 x 0.33: 7 -0.6,-0.54
DFN-10_DD = smd 0.813 x 0.279: 1 -1.448,1; 2 -1.448,0.5; 3 -1.448,0; 4 -1.448,-0.5; 5 -1.448,-1; 6 1.448,-1; 7 1.448,-0.5; 8 1.448,0; 9 1.448,0.5; 10 1.448,1 | smd 1.575 x 2.489: 11 0,0
QFN50P400X400X90-21N = smd 0.7 x 0.25: 1 -1.975,1; 2 -1.975,0.5; 3 -1.975,0; 4 -1.975,-0.5; 5 -1.975,-1; 11 1.975,-1; 12 1.975,-0.5; 13 1.975,0; 14 1.975,0.5; 15 1.975,1 | smd 0.25 x 0.7: 6 -1,-1.975; 7 -0.5,-1.975; 8 0,-1.975; 9 0.5,-1.975; 10 1,-1.975; 16 1,1.975; 17 0.5,1.975; 18 0,1.975; 19 -0.5,1.975; 20 -1,1.975 | smd 2.7 x 2.7: 21 0,0

### Placement (x,y rotation side)
C1  19.49,65.8 270 top
C2  18.66,65.8 270 top
C3  26.54,70.44 0 top
C4  26.54,69.63 0 top
C5  26.55,68.76 0 top
C6  27.06,71.74 0 top
C7  19.22,75.38 90 top
C8  20.07,63.52 180 top
C9  20.07,64.34 180 top
C10  24.32,65.19 270 top
C11  23.49,63.24 270 top
C12  21.58,61.73 180 top
C13  21.61,60.66 180 top
C14  23.84,61.2 270 top
C15  26.55,67.09 0 top
C16  28.49,67.09 0 top
C17  23.44,59.09 270 top
C18  24.81,56.05 0 top
C19  20.76,56.14 180 top
C20  28.22,40.87 0 top
C21  27.95,43.32 180 top
C22  18.62,29.28 180 top
C23  27.64,76.9 180 top
C24  29.87,74.21 90 top
C25  30.19,38.77 180 top
C26  27.28,54.68 270 top
C27  26.73,56.05 0 top
C28  33.43,70.08 180 top
C29  33.98,71.48 90 top
C30  42.61,63.37 180 top
C31  42.61,62.39 180 top
C32  42.9,61.11 0 top
C33  32,72.97 90 top
C34  36.08,41.02 270 top
C35  35.29,41.02 270 top
C36  35.72,43.63 0 top
C37  37.82,43.61 180 top
C38  29.67,25.89 0 top
C39  35.02,21.85 90 top
C40  35.02,24.26 90 top
C41  25.2,17.69 270 top
C42  16.24,20.76 180 top
C44  30.2,39.63 180 top
C45  72.82,28.95 270 top
C46  73.93,28.95 270 top
C47  76.46,31.59 0 top
C48  80.35,26.58 90 top
C49  58.47,28.53 0 top
C50  60.89,30.65 0 top
C51  59.09,25.14 180 top
C52  63,26.58 90 top
C53  57.19,18.32 0 top
C54  57.08,29.84 180 top
C63  71.8,29.27 270 top
C70  73.92,33.4 0 top
CN1  69,7.3 0 bottom
I1  21.46,65.43 0 top
I5  34.84,56.05 0 top
I6  37.51,70.08 180 top
I7  40.96,65.06 180 top
IC1  21.54,70.58 180 top
IC2  38.27,41.19 0 top
IC3  38.07,63.55 90 top
IC4  22.46,23.9 180 top
IC9  30.79,42.16 180 top
L1  64.06,22.76 90 top
L2  23.49,65.19 270 top
L3  26.55,67.92 0 top
L4  77.26,25.48 0 top
L5  23.05,61.19 270 top
MISO2  7.4,34.6 90 bottom
MOSI2  5.5,34.6 90 bottom
NSS2  11.22,34.57 0 bottom
PA8  5.5,28.57 90 bottom
PA11  7.32,28.58 90 bottom
PA12  9.23,28.57 90 bottom
PB7  21.56,12.38 0 bottom
PB8  23.44,12.41 0 bottom
PB9  25.24,12.38 0 bottom
PC13  31.93,15.55 270 bottom
PC14  31.93,17.44 0 bottom
PC15  31.93,19.3 90 bottom
Q1  27.74,74.51 270 top
Q2  32.63,23.15 90 top
R1  19.24,56.99 270 top
R2  37.24,56.05 0 top
R3  51.86,35.3 180 top
R4  62.88,40.7 270 top
R5  22.13,30.23 270 top
R6  31.11,30.12 180 top
R7  31.12,29.26 180 top
R8  80.47,28.74 0 top
R9  80.47,29.93 180 top
R10  58.5,27.32 180 top
R11  63.85,28.22 180 top
R12  58.47,26.14 0 top
R13  61.69,25.65 270 top
R14  61.34,18.47 270 top
R15  59.81,19.17 180 top
R16  31.13,27.5 180 top
R17  31.12,28.37 180 top
R18  29.95,23.4 270 top
R19  23.2,17.18 270 top
R20  22.66,15.77 0 top
R21  27.83,16.25 90 top
R22  79.73,32.97 180 top
R23  27.06,31.04 270 top
R24  26.25,31.04 270 top
R25  58.4,33.13 0 top
S1  21.99,57.32 270 top
S2  30.56,71.37 270 top
SCK2  9.33,34.58 90 bottom
SV2  11.66,18.07 270 top
SWCLK  17.8,23.99 270 bottom
SWIO  15.97,23.99 90 bottom
TP1  53.4,29.8 0 top
TP2  53.4,18.4 0 top
TP3  67.1,18.4 0 top
TP4  69.1,32.6 0 top
TP5  69.1,23.9 0 top
TP6  83.8,23.9 0 top
TP7  83.8,32.6 0 top
TP8  43.2,47.7 0 top
TP9  17.5,47.7 0 top
TP10  43.2,79.4 0 top
TP11  17.5,79.4 0 top
TP12  30.26,77.24 0 top
TP13  33.73,77.2 0 top
TP14  32.02,74.96 0 top
TP15  55.5,12.92 0 bottom
TP17  67.1,29.8 0 top
TR1  60.37,39.41 180 top
TR2  50.62,37.91 90 top
TR3  65.08,38.33 90 top
TR6  48.83,34.27 270 top
U1  75.91,29.2 270 top
U2  59.91,22.09 180 top
U3  -16,70 0 top  (outside the outline)
VBAT  27.6,20.61 0 bottom

### Tracks (layer width: path | path; a pad name or v marks a point on that pad's centre or on a via)
5VB_EN  (via drill 0.35, 0.41)
  Top 0.203: IC4.42 22.21,20.77 22.4,20.96 23.12,20.96 23.4,21.24 v23.4,21.7 | U1.2 78.11,29.45 v78.2,29.54 | R22.2 v78.2,32.97
  Bottom 0.203: v23.4,21.7 23.78,22.08 30.47,22.08 31.86,23.47 31.86,32.74 32.74,33.62 45.24,33.62 46.26,34.64 77.51,34.64 78.2,33.95 v78.2,32.97 v78.2,29.54
+3V1
  Top 0.203: C5.1 25.72,68.76 25.2,69.28 IC1.2
+3V2
  Top 0.203: IC1.4 24.88,70.58 26.04,71.74 C6.1
+3V3  (via drill 0.35, 0.41)  (1 unrouted)
  Top 0.203: IC1.3 25.29,69.93 25.59,69.63 C4.1 C3.1 25.99,70.86 26.2,71.07 27.77,71.07 v28.01,70.83 v28.01,70.82 | IC1.24 20.89,66.8 20.44,66.35 C1.1 C2.1 18.17,66.35 17.93,66.11 17.93,64.63 18.24,64.32 v18.63,64.32 | IC2.5 38.27,41.75 38.07,41.55 36.1,41.55 C34.1 C35.1 34.98,41.57 34.59,41.96 v34.59,42.58 | IC1.14 19.22,73.92 C7.1 18.59,74.83 18.28,75.14 v18.28,76.24 | U2.6 58.03,23.09 | IC9.5 30.75,40.82 C44.1 C25.1 31.77,38.77 v31.79,38.75 | IC4.24 19.71,28.74 C22.1 v19.17,30.15 | IC4.9 27.89,25.15 28.63,25.89 C38.1 29.12,25.3 v28.55,24.73 | IC4.48 C41.1 25.77,18.24 v26.14,17.87 | IC4.36 17.02,21.15 16.79,20.92 C42.1 16.83,20.72 v16.83,19.85 | R21.2 v26.88,16.8 v26.87,16.81
  Top 0.254: 58.03,23.09 57.62,23.5
  Top 0.305: 57.62,27.29 R10.2
  Top 0.406: 57.62,23.5 R12.1
  Top 0.508: TR2.8 49.13,43.38 TR2.7 | 49.59,41.73 49.86,41.46 49.48,41.09 TR2.10
  Top 0.813: 55.73,32.6 55.72,32.61 v55.72,32.93 v55.73,32.92 v55.73,31.78
  Top 1.016: v44.56,41.31 v45.79,41.31 45.8,41.33 49.11,41.33 TR2.10 49.35,43.16 49.13,43.38 | R12.1 57.62,27.29 | R10.2 57.65,28.5 C49.1 C54.1 58.44,30.65 C50.1 R25.2 | R25.1 55.94,33.13 v55.73,32.92
  Route15 0.203: v31.79,38.75 32.99,38.75 34.51,40.27 34.51,42.65 34.59,42.73 34.59,43.09
  Route15 0.813: 55.21,32.93 51.94,32.93 51.44,33.43 | 55.21,32.93 v55.72,32.93 | 55.21,32.93 55.73,32.41 v55.73,31.78
  Route15 1.016: 47.86,33.43 46.58,34.71 46.58,40.52 v45.79,41.31 v44.56,41.31 35.85,41.31 v34.58,42.58 v34.59,42.58 34.59,43.09 34.59,48.2 33.42,49.37 27.14,49.37 26.38,50.12 26.38,70.54 26.67,70.83 v28,70.83 v28.01,70.82 | 47.86,33.43 51.44,33.43 | v28.08,30.13 28.08,32.26 29.25,33.43 47.86,33.43
  pour Route15 (isolate 0.406): 28.28,73.22 19,73.22 19,77 17.5,77 17.5,63.55 28.28,63.55
  pour Route15: 14,31 30,31 31,30 31,16 30,15 14,15 13,16 13,30
+3V4
  Top 0.203: IC1.25 21.54,66.2 20.77,65.43 I1.1 C9.1 C8.1
+5V  (via drill 0.35)
  Top 0.203: R8.2 82.01,28.74 82.45,29.18 82.45,31.82 81.98,32.29 74.47,32.29 73.93,31.75 C46.1
  Top 0.254: U1.7 75.08,29.8
  Top 0.305: C63.1 72.8,29.82 C45.1
  Top 0.508: TR1.7 54.91,38.35 | 54.91,38.35 54.91,38 | 54.91,38 TR1.8 | 54.91,38 57.2,38 TR1.10 56.98,38.35 54.91,38.35
  Top 0.61: 75.08,29.8 C46.1
  Top 0.813: C45.1 C46.1
  Top 1.016: TR1.10 57.2,35.88 v57.21,35.86 v56.1,35.86 | C45.1 v72.82,31.73 v72.81,31.74 C70.1
  Route15 1.016: v72.81,30.83 v72.81,31.74 72.81,34.64 71.59,35.86 v57.21,35.86 v56.1,35.86
AMP_3VEN  (via drill 0.35)
  Top 0.203: v21.76,22.5 21.3,22.04 21.3,20.97 21.21,20.88 IC4.40 | v44.97,35.22 TR6.2
  Bottom 0.203: v21.76,22.5 22.22,22.96 30.06,22.96 30.98,23.88 30.98,33.12 32.42,34.56 44.72,34.56 44.97,34.81 v44.97,35.22
AMP_5VEN  (via drill 0.35)
  Top 0.203: TR3.2 v63.4,37.38 | IC4.41 21.71,21.25 22.16,21.7 v22.38,21.7
  Bottom 0.203: v63.4,37.38 62.76,36.74 54.81,36.74 53.15,35.08 46.02,35.08 45.03,34.09 32.56,34.09 31.43,32.96 31.43,23.68 30.27,22.52 23.05,22.52 22.38,21.85 v22.38,21.7
AMPIN
  Top 0.42: C18.2 C27.1
AMPPWR  (via drill 0.35)
  Top 0.203: v50.59,44.66 v50.6,44.67 50.6,44.69
  Top 0.254: TR2.9 | TR2.9 51.68,41.29 51.26,41.72 | 52.52,41.73 TR2.9
  Top 0.813: TR2.6 51.88,43.38 | 51.88,43.38 TR2.5 | TR1.5 54.91,40.62 | TR1.6 54.91,40.62 | TR1.9 57.13,40.62 54.91,40.62 | 54.91,40.62 54.87,40.66 52.31,40.66 51.68,41.29 | TR2.9 51.89,43.37 51.88,43.38 | v42.05,58.94 v42.05,59.96 C32.1 C31.2 C30.2 I7.1
  Top 1.016: 51.88,43.38 51.82,43.44 v51.82,44.69 50.6,44.69
  Route2 0.813: v42.05,58.94 v42.05,59.96
  Route15 1.016: v42.05,59.96 v42.05,58.95 | 50.59,44.69 v51.82,44.69 44.46,44.69 43.09,46.06 43.09,57.9 v42.05,58.94
C_UART_RX
  Top 0.203: R6.2 30.11,30.12 27.14,27.14 25.38,27.14 25.21,27.31 IC4.13
C_UART_TX
  Top 0.203: IC4.12 27.32,26.65 29.93,29.26 R7.2
CP_DIO_1  (via drill 0.35)
  Top 0.203: v33.23,27.5 R16.1
  Bottom 0.203: v33.23,27.5 33.5,27.23 33.5,13.54 32.93,12.97 28.64,12.97 28.01,12.34 28.01,8.29 CN1.42
CP_DIO_2  (via drill 0.35)
  Top 0.203: v32.54,28.36 R17.1
  Bottom 0.203: CN1.43 27.55,9.85 27.55,12.56 28.47,13.48 32.74,13.48 33.05,13.79 33.05,26.64 32.54,27.15 v32.54,28.36
CP_UART_RX  (via drill 0.35)
  Top 0.203: v32.55,30.12 R6.1
  Bottom 0.203: CN1.40 29.99,8.31 29.99,11.56 30.41,11.98 33.22,11.98 34.47,13.24 34.47,29.39 33.74,30.12 v32.55,30.12
CP_UART_TX  (via drill 0.35)
  Top 0.203: v33.23,29.25 R7.1
  Bottom 0.203: CN1.41 29.51,9.81 29.51,11.75 30.23,12.47 33.06,12.47 33.99,13.4 33.99,28.49 v33.23,29.25
CW_KEY  (via drill 0.35)
  Top 0.203: IC9.1 31.74,42.46 v31.75,42.45 | IC4.38 20.21,21.21 20.48,21.48 20.48,23.61 21.26,24.39 v21.26,24.47
  Bottom 0.203: v21.26,24.47 21.64,24.47 22.27,23.84 29.67,23.84 30.1,24.27 30.1,41.58 30.97,42.45 v31.75,42.45
DIO0  (via drill 0.35)
  Top 0.203: IC1.8 23.49,75.44 v23.64,75.59 | IC4.19 22.21,26.02 22.86,25.37 v23.4,25.37
  Bottom 0.203: v23.64,75.59 23.64,74.48 20.36,71.2 20.36,47.01 21.03,46.34 24.7,46.34 25.46,45.57 25.46,29.34 24.15,28.04 24.15,25.62 23.9,25.37 v23.4,25.37
DIO1  (via drill 0.35)
  Top 0.203: IC1.9 22.84,75.35 v22.64,75.55 | IC4.18 22.71,26.63 22.99,26.35 v23.39,26.35
  Bottom 0.203: v22.64,75.55 22.64,74.17 19.92,71.45 19.92,46.76 20.81,45.87 24.52,45.87 25.01,45.38 25.01,29.47 23.74,28.2 23.74,26.68 23.41,26.35 v23.39,26.35
DIO2  (via drill 0.35)
  Top 0.203: IC1.10 22.19,74.46 21.57,75.08 v21.57,75.59 | v19.62,31.41 20.71,30.32 IC4.22
  Bottom 0.203: v21.57,75.59 21.32,75.84 20.29,75.84 19.4,74.95 13.4,74.95 12.79,74.34 12.79,41.11 13.73,40.17 19.02,40.17 19.62,39.57 v19.62,31.41
GND  (via drill 0.35, 0.8 pad 1.6)
  Top 0.203: U2.2 60.41,21.59 U2.11 | IC4.23 v20.21,26.36 | IC4.8 24.47,24.65 v24.36,24.54 v24.35,24.53 24.35,21.41 24.71,21.05 IC4.47 | v19.78,21.84 19.59,21.65 IC4.35 | R20.1 21.32,15.78 v21.19,15.65 | U2.3 62.02,22.09 62.15,21.96 62.15,19.75 v62.66,19.24
  Top 0.254: 22.19,69.93 IC1.29 | IC1.26 22.19,66.56 v22.3,66.45
  Top 0.305: IC1.23 20.24,69.05 | 20.24,69.05 20.24,69.28 | 20.24,69.28 IC1.29 | IC1.22 19.59,68.63 20.24,69.28 | IC1.21 19.82,68.63 20.24,69.05 | IC1.26 22.19,69.93 | IC1.15 20.25,72.53 21.28,71.5
  other vias: 78.92,31.37 79.91,31.37 80.92,31.37 25.93,73.65 14.5,57.5 14.5,58.5 14.5,59.5 14.5,60.5 14.5,61.5 14.5,56.5 14.5,55.5 14.5,54.5 14.5,53.5 14.5,52.5 14.5,51.5 14.5,50.5 14.5,49.5 14.5,48.5 14.5,47.5 15.5,47.75 19.2,47.75 44.5,47.5 45.5,47.5 46.25,48.75 46.25,49.75 46.25,50.75 46.25,51.75 46.25,52.75 46.25,53.75 46.25,54.75 46.25,55.75 46.25,56.75 46.25,57.75 46.25,58.75 46.25,59.75 46.25,66.75 46.25,67.75 46.25,68.75 46.25,69.75 46.25,70.75 46.25,71.75 46.25,60.75 46.25,61.75 46.25,62.75 46.25,63.75 46.25,64.75 46.25,65.75 21.25,79.5 20.25,79.5 19.25,79.5 16.25,79.5 27.25,79.5 26.25,79.5 25.25,79.5 24.25,79.5 23.25,79.5 22.25,79.5 29.25,79.5 28.25,79.5 39.14,79.5 38.03,79.51 36.9,79.5 35.79,79.5 34.75,79.51 46.25,72.75 46.25,73.75 46.25,74.75 46.25,75.75 46.25,76.75 46.25,77.75 45.25,79.5 41.25,79.5 40.25,79.5 46.25,78.75 46.25,79.75 14.5,68.5 14.5,69.5 14.5,70.5 14.5,71.5 14.5,72.5 14.5,73.5 14.5,62.5 14.5,63.5 14.5,64.5 14.5,65.5 14.5,66.5 14.5,67.5 14.5,76.5 14.5,77.5 14.5,78.5 15.25,79.5 14.25,79.5 36.62,62.12 32.75,63.62 32.75,62.62 32.75,64.62 33.62,62.12 34.62,62.12 35.62,62.12 33.62,65 34.62,65 35.62,65 36.62,65 35.62,66 34.62,66 33.62,66 35.62,61.12 34.62,61.12 33.62,61.12 31.75,63.62 31.75,62.62 31.75,64.62 32.75,65.62 31.75,65.62 32.75,61.62 31.75,61.62 33.62,67 34.62,67 35.62,67 32.75,66.62 31.75,66.62 31.75,60.62 32.75,60.62 33.62,60.12 34.62,60.12 35.62,60.12 26.12,47.75 25.12,47.75 23.07,47.74 41.77,47.5 38.38,47.5 37.38,47.5 36.38,47.5 27.12,47.75 28.12,47.75 29.12,47.75 30.12,47.75 31.12,47.75 32.12,47.75 33.12,47.75 30.75,63.62 30.75,62.62 30.75,64.62 30.75,65.62 30.75,61.62 30.75,66.62 30.75,60.62 21.05,47.71 40.02,47.5 44.25,77.25 42.75,77.25 41.25,77.25 39.75,77.25 38.25,77.25 36.75,77.25 35.25,77.25 35.25,74.25 35.25,75.75 36.75,75.75 36.75,74.25 36.75,72.75 38.25,72.75 39.75,72.75 39.75,74.25 38.25,74.25 38.25,75.75 39.75,75.75 41.25,75.75 42.75,75.75 44.25,75.75 41.25,74.25 41.25,72.75 41.25,71.25 41.25,69.75 42.75,69.75 42.75,71.25 42.75,72.75 42.75,74.25 44.25,74.25 44.25,72.75 44.25,71.25 44.25,69.75 44.25,68.25 44.25,66.75 44.25,65.25 42.75,66.75 42.75,68.25 25.5,77.25 24,77.25 22.5,77.25 21,77.25 19.5,77.25 16.5,77.25 16.5,75.75 16.5,73.5 33.14,72.74 35.25,72.75 18.75,49.5 18.75,51 18.75,52.5 18.75,54 18.75,59.25 18.75,60.75 18.75,62.25 27.75,59.25 27.75,60.75 27.75,62.25 27.75,63.75 27.75,65.25 29.25,65.25 29.25,63.75 29.25,62.25 29.25,60.75 29.25,59.25 30.75,59.25 33,68.25 31.5,68.25 29.25,68.25 29.25,69.75 27.75,52.5 29.25,52.5 30.75,52.5 32.25,52.5 33.75,52.5 35.25,52.5 36.75,52.5 38.25,52.5 38.25,51 38.25,49.5 36.75,49.5 36.75,51 35.25,51 33.75,51 32.25,51 30.75,51 29.25,51 27.75,51 23.25,49.5 23.25,51 23.25,52.5 23.25,54 40.02,49.5 40.02,51 40.02,52.5 40.02,54 41.81,49.5 41.81,51 41.81,52.5 41.81,54 41.81,55.5 41.81,57 21.05,49.51 21.05,51.01 21.05,52.51 21.05,54.01 44.52,49.5 44.52,51 44.52,52.4 44.52,54 44.52,55.5 44.52,57 44.22,59.2 30.89,72.74 30.16,80.81 33.84,80.78 6,42 6,45 6,48 6,51 6,54 6,57 6,60 6,63 6,66 6,69 6,72 6,75 6,78 6,81 9,81 12,81 12,84 9,84 9,42 9,45 12,42 12,45 9,48 9,51 9,54 9,57 9,60 9,63 9,66 9,69 9,72 12,48 12,51 12,54 12,57 12,60 12,63 12,66 12,69 12,72 48,57 48,60 48,63 48,66 48,69 48,72 48,75 48,78 48,81 51,57 51,60 51,63 51,66 51,69 51,72 51,75 51,78 51,81 54,57 54,60 54,63 54,66 54,69 54,72 54,75 54,78 54,81 57,57 57,60 57,63 57,66 57,69 57,72 57,75 57,78 57,81 60,57 60,60 60,63 60,66 60,69 60,72 60,75 60,78 60,81 63,57 63,60 63,63 63,66 63,69 63,72 63,75 63,78 63,81 66,57 66,60 66,63 66,66 66,69 66,72 66,75 66,78 66,81 69,57 69,60 69,63 69,66 69,69 69,72 69,75 69,78 69,81 72,57 72,60 72,63 72,66 72,69 72,72 72,75 72,78 72,81 75,48 75,51 75,54 75,57 75,60 75,63 75,66 75,69 75,72 78,48 78,51 78,54 78,57 78,60 78,63 78,66 78,69 78,72 84,48 84,51 84,54 84,57 84,60 84,63 84,66 84,69 84,72 81,48 81,51 81,54 81,57 81,60 81,63 81,66 81,69 81,72 84,45 81,45 78,45 75,45 72,45 69,45 66,45 63,45 60,45 39,84 36,84 33,84 30,84 27,84 24,84 21,84 18,84 15,84 66,84 63,84 60,84 57,84 54,84 51,84 48,84 45,84 42,84 84,84 81,84 78,84 75,84 72,84 69,84 84,81 81,81 78,81 75,81 75,78 75,75 84,75 84,78 15,81 18,81 21,81 24,81 27,81 36,81 39,81 45,81 42,81 6,39 9,39 12,39 15,42 15,45 15,39 18,39 18,36 15,36 15,33 18,33 36,30 39,30 39,27 42,27 42,30 42,36 39,36 36,36 33,36 45,39 42,39 42,45 33,45 30,45 45,30 48,30 51,30 51,27 48,27 45,27 39,24 39,21 42,21 42,24 45,24 45,21 48,21 48,24 51,24 51,21 51,18 48,18 45,18 42,18 39,18 39,15 42,15 45,15 48,15 51,15 69,15 72,15 75,15 78,15 81,15 84,15 84,18 84,21 84,27 84,30 84,36 81,36 78,36 75,36 62.31,33.06 69,27 69,21 72,21 75,21 78,21 72,24 72,27 81.36,33.02 72,39 69,39 69,42 66,42 72,42 75,42 75,39 78,39 78,42 81,42 81,39 84,39 84,42 57,45 54,45 84,12 84,9 84,6 81,12 78,12 75,12 72,12 69,12 66,12 75,9 75,6 75,3 78,3 81,3 72,3 72,6 69,3 66,3 63,3 60,3 57,3 54,3 51,3 48,3 45,3 42,3 39,3 36,3 33,3 30,3 27,3 24,3 21,3 18,3 15,3 12,3 9,3 6,6 6,9 6,12 9,12 12,12 15,12 18,12 18,9 18,6 15,6 15,9 6,15 6,18 6,21 18,15 9,24 6,24 21,33 21,36 21,39 21,42 18,42 21,45 24,45 24,36 24,39 24,42 27,33 27,36 27,39 27,45 36,12 39,12 42,12 45,12 54,12 57,12 63,12 60,12 36,27 36,15 36,18 36,21 61.17,28.24 55.8,23.99 64.91,33.04 64.91,29.57 48,54 51,54 54,54 57,54 60,54 63,54 66,54 69,54 72,54 48,51 51,51 54,51 57,51 60,51 63,51 66,51 69,51 72,51 48,48 51,48 54,48 57,48 60,48 63,48 66,48 69,48 72,48
  pour Top (isolate 0.305): -1,-1 -1,88 91,88 91,-1
  pour Bottom (isolate 0.203): -4,91 -4,-4 94,-4 94,90 91,90 90,91
  pour Route2 (isolate 0.406): -2,-2 -2,89 92,89 92,-2
  pour Route15 (isolate 0.406, rank 2): -3,-3 93,-3 93,90 -3,90
MISO  (via drill 0.35)
  Top 0.203: IC1.17 17.25,71.23 v16.75,70.73 | v22.6,33.15 23.71,32.04 IC4.16
  Bottom 0.203: v22.6,33.15 22.57,33.15 22.24,33.48 22.24,42.52 21.58,43.18 17.65,43.18 16.67,44.16 16.67,66.15 16.28,66.54 16.28,67.74 16.94,68.4 16.94,70.54 v16.75,70.73
MOSI  (via drill 0.35)
  Top 0.203: IC1.18 17.73,70.58 16.72,69.57 v16.19,69.57 | v22.37,32.18 23.21,31.34 IC4.17
  Bottom 0.203: v22.37,32.18 21.77,32.78 21.77,42.31 21.37,42.71 17.48,42.71 16.23,43.96 16.23,65.97 15.85,66.35 15.85,67.94 16.19,68.28 v16.19,69.57
N$1
  Top 0.42: L2.2 C11.1
N$2
  Top 0.254: L5.1 C12.1
  Top 0.42: C14.1 23.46,61.74 | 23.46,61.74 L5.1 | 23.46,61.74 23.49,61.77 C11.2
N$3
  Top 0.254: C13.1 23.03,60.66 L5.2
  Top 0.42: C14.2 23.44,60.64 | 23.44,60.64 L5.2 | C17.1 23.44,60.64
N$4
  Top 0.305: S1.6 C17.2
N$5
  Top 0.406: C15.2 C16.1
N$6
  Top 0.305: C18.1 23.72,56.05 S1.4
N$7
  Top 0.305: C19.1 21.89,56.14 21.99,56.24 S1.3
N$8
  Top 0.42: R1.2 C19.2
N$9
  Top 0.42: I5.1 C27.2 C26.1
N$10  (via drill 0.35)
  Top 0.203: S2.5 S2.5 arc-90 S2.5 | v32.96,71.27 32.96,71.21 32.62,70.87 S2.5 | C37.1 39.21,43.61 | 39.21,43.61 v39.21,43.65 | 39.21,43.61 39.22,43.6 IC2.4 39.22,41.22 38.85,40.85 37.64,40.85 37.32,40.53 IC2.1
  Route15 0.203: v39.21,43.65 40.92,45.36 40.92,68.33 37.98,71.27 v32.96,71.27
N$11  (via drill 0.35)
  Top 0.203: IC9.4 C20.2 28.77,41.79 v28.56,42 | S1.2 21.41,56.82 v21.05,57.17
  Route15 0.203: v28.56,42 25.61,42 22.03,45.58 22.03,56.33 21.19,57.17 v21.05,57.17
N$12
  Top 0.42: R2.1 I5.2
N$13
  Top 0.42: IC3.1 38.09,62.03 R2.2
N$14
  Top 0.254: IC3.3 I7.2
  Top 0.42: I6.1 IC3.3
N$15
  Top 0.42: I6.2 C28.1 C29.1
N$16
  Top 0.254: S2.4 arc90 32.3,70.08
  Top 0.42: C28.2 32.3,70.08
N$17
  Top 0.203: C33.1
  Top 0.3: S2.6 C33.1
N$18  (via drill 0.35)
  Top 0.254: TR1.3 v61.63,40.05 | v61.63,40.05 v61.64,40.04 | R4.2 62.69,40.05 v61.63,40.05 | TR1.1 v61.63,37.51 v61.64,37.5
  Bottom 0.254: v61.64,40.04 61.2,40.04 60.73,39.57 60.73,38.03 61.26,37.5 v61.64,37.5
N$19  (via drill 0.35)
  Top 0.254: TR2.3 v51.26,36.62 | v51.26,36.62 v51.25,36.62 | v48.73,36.61 48.73,37.9 TR2.1 | R3.2 51.26,35.55 v51.26,36.62
  Bottom 0.254: v51.25,36.62 51.25,37.33 50.92,37.66 49.04,37.66 48.73,37.35 v48.73,36.61
N$20  (via drill 0.35)
  Top 0.203: S2.2 v29.81,70.87 | IC2.6 37.24,42.57 v36.45,42.57 36.45,43.45 C36.2
  Route15 0.203: v29.82,70.86 v29.81,70.87 29.81,70.73 30.88,69.66 37.54,69.66 39.17,68.02 39.17,45.87 36.45,43.15 v36.45,42.57
N$22  (via drill 0.35)
  Top 0.203: TR3.3 64.03,40.91 63.57,41.37 63.06,41.37 R4.1
  Top 0.254: TR1.4 61.62,41.31 | 61.62,41.31 v61.63,41.3 | R4.1 62.65,41.31 61.62,41.31 | TR1.2 v61.63,38.77 v61.64,38.77
  Bottom 0.254: v61.63,41.3 62.2,41.3 62.59,40.91 62.59,39.1 62.26,38.77 v61.64,38.77
N$23  (via drill 0.35)
  Top 0.254: TR2.4 v52.52,36.62 | v52.52,36.62 v52.53,36.62 | v49.98,36.62 TR2.2 | R3.1 52.52,35.48 52.52,35.61 | 52.52,35.61 v52.52,36.62 | TR6.3 52.29,34.27 52.57,34.55 52.57,35.56 52.52,35.61
  Bottom 0.254: v52.53,36.62 52.53,35.99 52.19,35.65 50.3,35.65 49.98,35.97 v49.98,36.62
N$24  (via drill 0.35)
  Top 0.203: R16.2 29.57,27.5 27.72,25.65 IC4.10 25.1,25.65 v24.84,25.39 | v27.04,28.7 27.04,30.47 R23.2
  Bottom 0.203: v24.84,25.39 25.14,25.69 26.54,25.69 27.04,26.19 v27.04,28.7
N$25
  Top 0.203: IC4.20 21.71,29.26 R5.2
N$26  (via drill 0.35)
  Top 0.203: R17.2 29.79,28.37 27.57,26.15 IC4.11 25.1,26.15 v24.84,26.41 | v26.25,29.48 R24.2
  Bottom 0.203: v24.84,26.41 25.52,26.41 26.25,27.14 v26.25,29.48
N$27  (via drill 0.35)
  Top 0.203: v24.26,57.26 24.26,57.15 23.93,56.83 S1.5 | IC9.6 31.74,41.57 31.47,41.84 30.14,41.84 29.84,42.14 IC9.3 29.72,43.32 C21.1 28.26,43.55 v28.26,44.19
  Route15 0.203: v24.26,57.26 24.23,57.23 24.23,46.38 26.42,44.19 v28.26,44.19
N$28
  Top 0.203: IC4.5 29.35,23.15 R18.2 32.48,22.55 Q2.1 C39.1
N$29
  Top 0.203: IC4.6 29.36,23.65 R18.1 30.78,24.25 Q2.3 31.53,24.19 32.01,23.71 C40.1
N$30
  Top 0.254: U2.4 62.73,22.59 L1.1
N$31
  Top 0.203: R9.2 R8.1 77.59,28.74 77.38,28.95 U1.3
N$32
  Top 0.254: L4.1 75.89,25.5 U1.5 75.89,31.57 C47.1
N$33
  Top 0.254: U2.5 62.89,23.09 L1.2
N$34
  Top 0.203: U1.1 77.01,30.15 C47.2
N$35  (via drill 0.35)
  Top 0.203: IC4.1 27.34,21.15 27.59,20.9 v27.59,19.18
  Bottom 0.203: VBAT.1 v27.6,19.19 v27.59,19.18
N$36
  Top 0.203: R12.2 58.86,26.14 58.54,25.82 C51.2
N$37  (via drill 0.35)
  Top 0.203: 60.24,27.32 60.24,27.3 60.25,27.3 60.25,25.35 60.04,25.14 C51.1 59.62,25.12 v59.62,24.22 | R10.1 60.24,27.32 | R11.2 C52.2 62.67,27.46 60.38,27.46 60.24,27.32
  Top 0.254: U2.9 57.81,21.59 57.52,21.3 v57.52,20.37 v57.53,20.36
  Bottom 0.203: v57.53,20.36 57.96,20.79 59.31,20.79 59.62,21.1 v59.62,24.22
N$38
  Top 0.203: IC4.44 R19.1
N$39
  Top 0.203: R13.1 62.16,26.03 C52.1
N$40  (via drill 0.35)
  Top 0.203: R13.2 61,24.8 v60.61,24.41 | v58.45,19.91 U2.10
  Bottom 0.203: v60.61,24.41 60.61,21 59.52,19.91 v58.45,19.91
N$41
  Top 0.254: U2.1 61.36,19.59 R14.1
N$42  (via drill 0.35)
  Top 0.203: v30.62,19.3 29.77,19.3 29.02,20.05 29.02,21.74 28.11,22.65 IC4.4
  Bottom 0.203: PC15.1 v30.62,19.3
N$44  (via drill 0.35)
  Top 0.203: IC4.3 27.95,22.15 28.58,21.52 28.58,19.84 30.57,17.85 v30.57,17.41
  Bottom 0.203: PC14.1 31.89,17.4 v30.58,17.4 v30.57,17.41
N$45  (via drill 0.35)
  Top 0.203: IC4.2 27.78,21.65 28.1,21.33 28.1,19.67 29.84,17.93 29.84,15.79 30.08,15.55 v30.59,15.55
  Bottom 0.203: PC13.1 v30.59,15.55
N$46  (via drill 0.35)
  Top 0.203: v7.42,33.16 7.42,31.97 8.13,31.26 13.29,31.26 14.27,30.27 14.27,26.82 15.44,25.65 IC4.27
  Bottom 0.203: v7.42,33.16 7.42,34.58 MISO2.1
N$47  (via drill 0.35)
  Top 0.203: v5.5,33.16 5.5,31.52 6.26,30.76 12.37,30.76 12.6,30.76 13.21,30.76 13.85,30.12 13.85,26.61 15.3,25.15 IC4.28
  Bottom 0.203: v5.5,33.16 MOSI2.1
N$48  (via drill 0.35)
  Top 0.203: v9.23,27.12 9.23,27.84 9.71,28.32 11.96,28.32 12.39,27.89 12.39,23.32 13.06,22.65 IC4.33
  Bottom 0.203: PA12.1 v9.23,27.12
N$49  (via drill 0.35)
  Top 0.203: v7.33,27.14 7.33,27.93 8.16,28.76 12.19,28.76 12.83,28.12 12.83,23.57 13.25,23.15 IC4.32
  Bottom 0.203: PA11.1 v7.33,27.14
N$50  (via drill 0.35)
  Top 0.203: v5.5,27.15 5.5,28.13 6.56,29.19 12.41,29.19 13.29,28.31 13.29,26.47 15.11,24.65 IC4.29
  Bottom 0.203: v5.5,27.15 PA8.1
N$68  (via drill 0.35)
  Top 0.203: v9.33,33.17 9.33,32.23 9.8,31.76 13.46,31.76 14.7,30.52 14.7,27.04 15.59,26.15 IC4.26
  Bottom 0.203: v9.33,33.17 SCK2.1
N$69  (via drill 0.35)
  Top 0.203: v11.22,33.2 11.22,32.57 11.53,32.26 13.54,32.26 15.15,30.65 15.15,27.27 15.77,26.65 IC4.25
  Bottom 0.203: v11.22,33.2 NSS2.1
NSSL  (via drill 0.35)
  Top 0.203: v17.37,67.15 v17.36,67.16 17.36,69.58 17.72,69.93 IC1.19 | v23.74,34.14 24.71,33.17 IC4.14
  Bottom 0.203: 17.45,67.07 v17.37,67.15 17.54,66.98 17.54,44.61 18,44.15 21.99,44.15 23.21,42.93 23.21,34.67 v23.74,34.14
NTRX_EN  (via drill 0.35)
  Top 0.203: v59.03,14.86 59.03,15.51 59.26,15.74 R15.2 57.29,19.17 56.87,19.59 56.87,21.75 57.21,22.09 U2.8
  Bottom 0.203: v59.03,14.86 59.03,13.33 58.62,12.92 TP15.1
PB7  (via drill 0.35)
  Top 0.203: IC4.43 22.71,18.55 22.29,18.13 20.6,18.13 20.08,17.61 20.08,14.2 20.54,13.74 v21.57,13.74
  Bottom 0.203: PB7.1 v21.56,13.73 v21.57,13.74
PB8  (via drill 0.35)
  Top 0.203: IC4.45 23.71,18.42 23.96,18.17 23.96,14.42 23.44,13.9 v23.44,13.76
  Bottom 0.203: v23.44,13.76 PB8.1
PB9  (via drill 0.35)
  Top 0.203: IC4.46 24.21,18.9 24.21,18.62 24.44,18.39 24.44,14.52 v25.24,13.72
  Bottom 0.203: v25.24,13.72 PB9.1
PROG_BOOT0  (via drill 0.35)
  Top 0.203: R19.2 R20.2 v23.21,14.77
  Bottom 0.203: v23.21,14.77 R20.2 22.59,16.38 13.57,16.38 12.93,15.74 SV2.6 12.93,15.2 13.71,14.42 15.84,14.42 17.22,13.04 17.22,5.85 17.83,5.24 65.36,5.24 66,5.88 66,8.3 CN1.3
PROG_RST  (via drill 0.35)
  Top 0.203: IC4.7 25.52,24.15 25.09,23.72 25.09,21.25 26.35,19.99 26.35,18.79 27.11,18.04 28.18,18.04 28.55,17.67 28.55,15.93 28.32,15.7 R21.1 27.78,15.75 v26.87,15.75
  Bottom 0.203: v26.87,15.75 23.94,15.75 22.83,16.86 11.05,16.86 10.39,16.2 SV2.5 10.39,14.83 11.23,13.99 15.61,13.99 16.77,12.83 16.77,5.66 17.68,4.75 66.25,4.75 67,5.5 CN1.4
PROG_RX  (via drill 0.35)
  Top 0.203: IC4.31 13.88,23.65 v13.7,23.84
  Bottom 0.203: v13.7,23.84 12.93,23.07 SV2.2 12.93,20.06 12.21,19.34 9.26,19.34 8.69,18.77 8.69,14.26 9.45,13.5 15.43,13.5 16.31,12.62 16.31,5.42 17.45,4.29 67.09,4.29 68,5.2 68,8.3 CN1.1
PROG_TX  (via drill 0.35)
  Top 0.203: IC4.30 14.4,24.15 v13.69,24.86
  Bottom 0.203: v13.69,24.86 12.13,23.3 12.13,22.1 10.64,20.61 SV2.1 8.92,20.61 8.27,19.96 8.27,14.06 9.28,13.05 15.19,13.05 15.88,12.36 15.88,5.17 17.22,3.83 67.88,3.83 69,4.95 CN1.2
RF_RX
  Top 0.254: S2.3 30.52,70.33 30.52,70.16
  Top 0.42: 30.52,70.16 30.51,70.15 30.51,68.85 30.51,68.56 arc-90 C16.2
RFI
  Top 0.305: C15.1 L3.1
  Top 0.406: IC1.1 24.52,67.83 arc90 25.25,67.09 C15.1
RFO
  Top 0.203: I1.2 22.62,65.74 L2.1
  Top 0.42: C10.1 L2.1 IC1.28
RST_L  (via drill 0.35)
  Top 0.203: v20.3,74.79 20.3,75.56 21.07,76.33 24.05,76.33 24.52,75.86 IC1.7 | v20.52,31.85 21.21,31.16 IC4.21
  Bottom 0.203: v20.3,74.79 20.02,74.51 13.65,74.51 13.26,74.12 13.26,41.27 13.91,40.62 19.23,40.62 20.06,39.8 20.06,32.31 v20.52,31.85
RX/TX_CON  (via drill 0.35)
  Top 0.203: IC2.3 v39.22,38.32 | IC4.39 20.71,21.01 20.89,21.19 20.89,22.98 v21.31,23.4
  Bottom 0.203: v39.22,38.32 39.22,38.26 38.79,37.83 31.43,37.83 30.55,36.95 30.55,24.09 29.86,23.4 v21.31,23.4
SCK  (via drill 0.35)
  Top 0.203: IC1.16 v16.74,71.88 | v23.71,33.11 24.21,32.61 IC4.15
  Bottom 0.203: 23.71,33.21 v23.71,33.11 22.74,34.08 22.74,42.68 21.76,43.66 17.84,43.66 17.11,44.39 17.11,66.35 16.7,66.76 16.7,67.53 17.5,68.33 17.5,71.42 17.04,71.88 v16.74,71.88
SWCLK  (via drill 0.35)
  Top 0.203: IC4.37 19.71,18.91 18.9,18.1 17.9,18.1 v17.87,18.13
  Bottom 0.203: v17.87,18.13 17.8,18.2 SWCLK.1
SWIO  (via drill 0.35)
  Top 0.203: IC4.34 16.53,22.15 v16.28,21.9
  Bottom 0.203: SWIO.1 15.97,22.21 v16.28,21.9
TOANT
  Top 0.406: TP14.1 32,74.94 C33.2
UNREG1  (via drill 0.35, 0.41)
  Top 0.203: U1.4 | 78.61,27.4 L4.2
  Top 0.254: U1.4 76.82,28.18
  Top 0.26: U2.7 56.83,22.59
  Top 0.305: 76.82,28.18 77.35,27.65 v77.99,27.65 78.36,27.65 78.61,27.4 | C53.1 56.34,22.1 56.83,22.59
  Top 0.406: C53.1 56.34,15.51 56.38,15.51 | 56.38,15.51 v56.38,14.97 | 56.38,15.51 56.92,15.51 v57.17,15.77
  Top 1.016: L4.2 78.86,25.73 C48.1 v80.35,24.39 v80.34,24.38 v80.34,23.33
  Route15 1.016: CN1.24 CN1.23 47,10.73 47.66,11.39 51.68,11.39 52.4,12.11 52.4,13.87 53.5,14.97 v56.38,14.97 v57.17,15.77 58.03,16.62 77.8,16.62 80.34,19.16 v80.34,23.33 80.34,24.91
XTA
  Top 0.203: IC1.5 24.88,71.23 26.02,72.37 27.82,72.37 28.39,72.94 Q1.3 C24.1
XTB
  Top 0.203: IC1.6 24.92,71.88 25.24,72.2 25.24,74.9 25.7,75.36 Q1.1 C23.2

### Text on the board
tPlace: RX | TX | U2 | GND | 3V3 | RST | B0